# EAGLE design dsy01 (EAGLE 7.7.0)
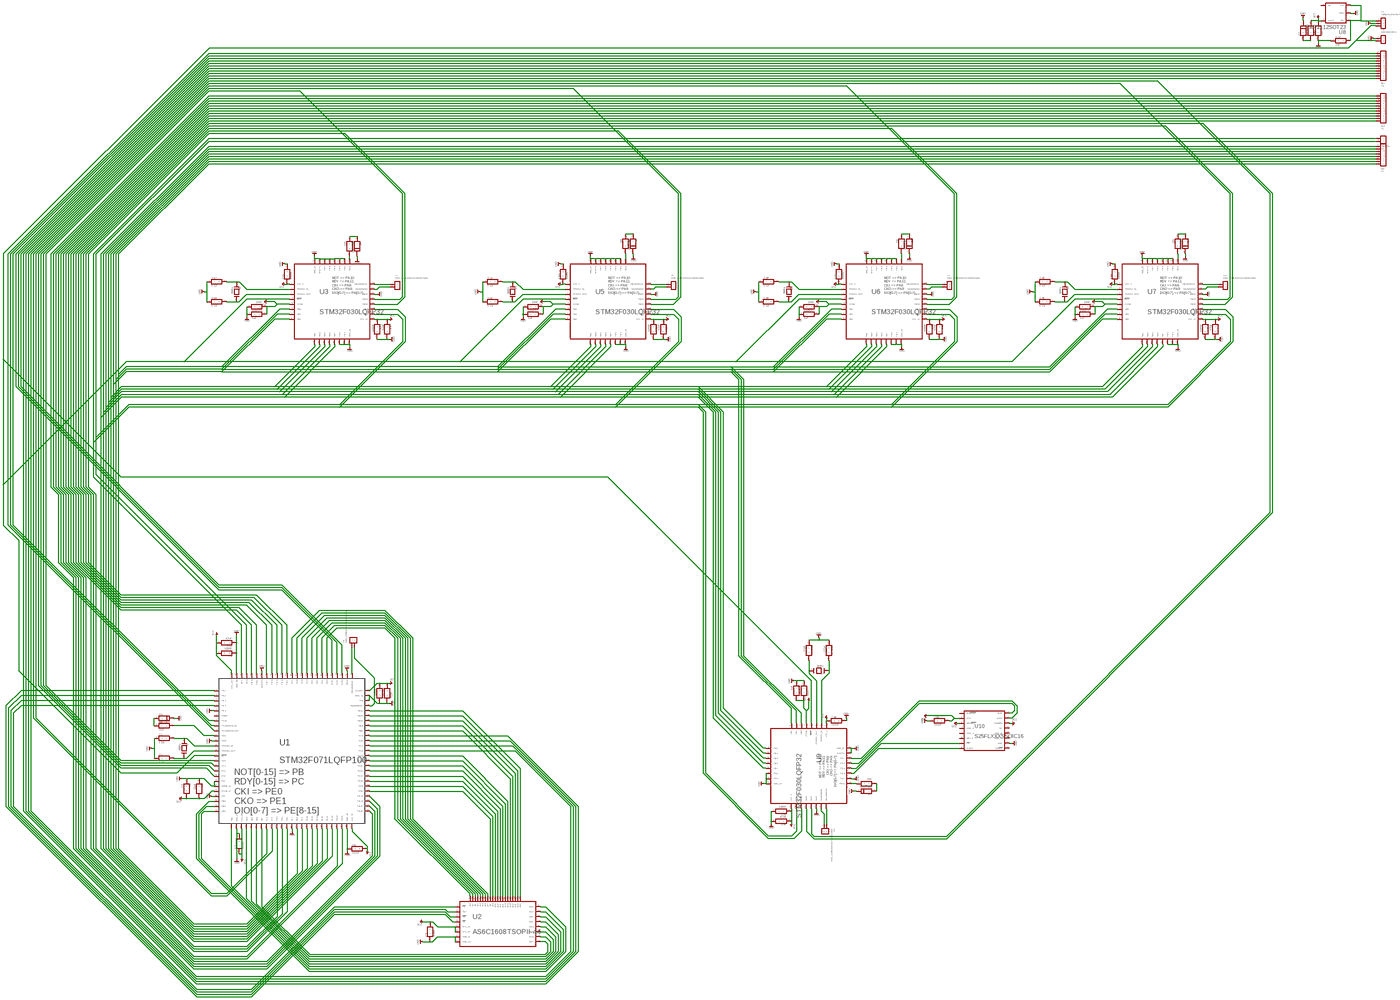
[diagram p0: schematic, sheet 1, overview]
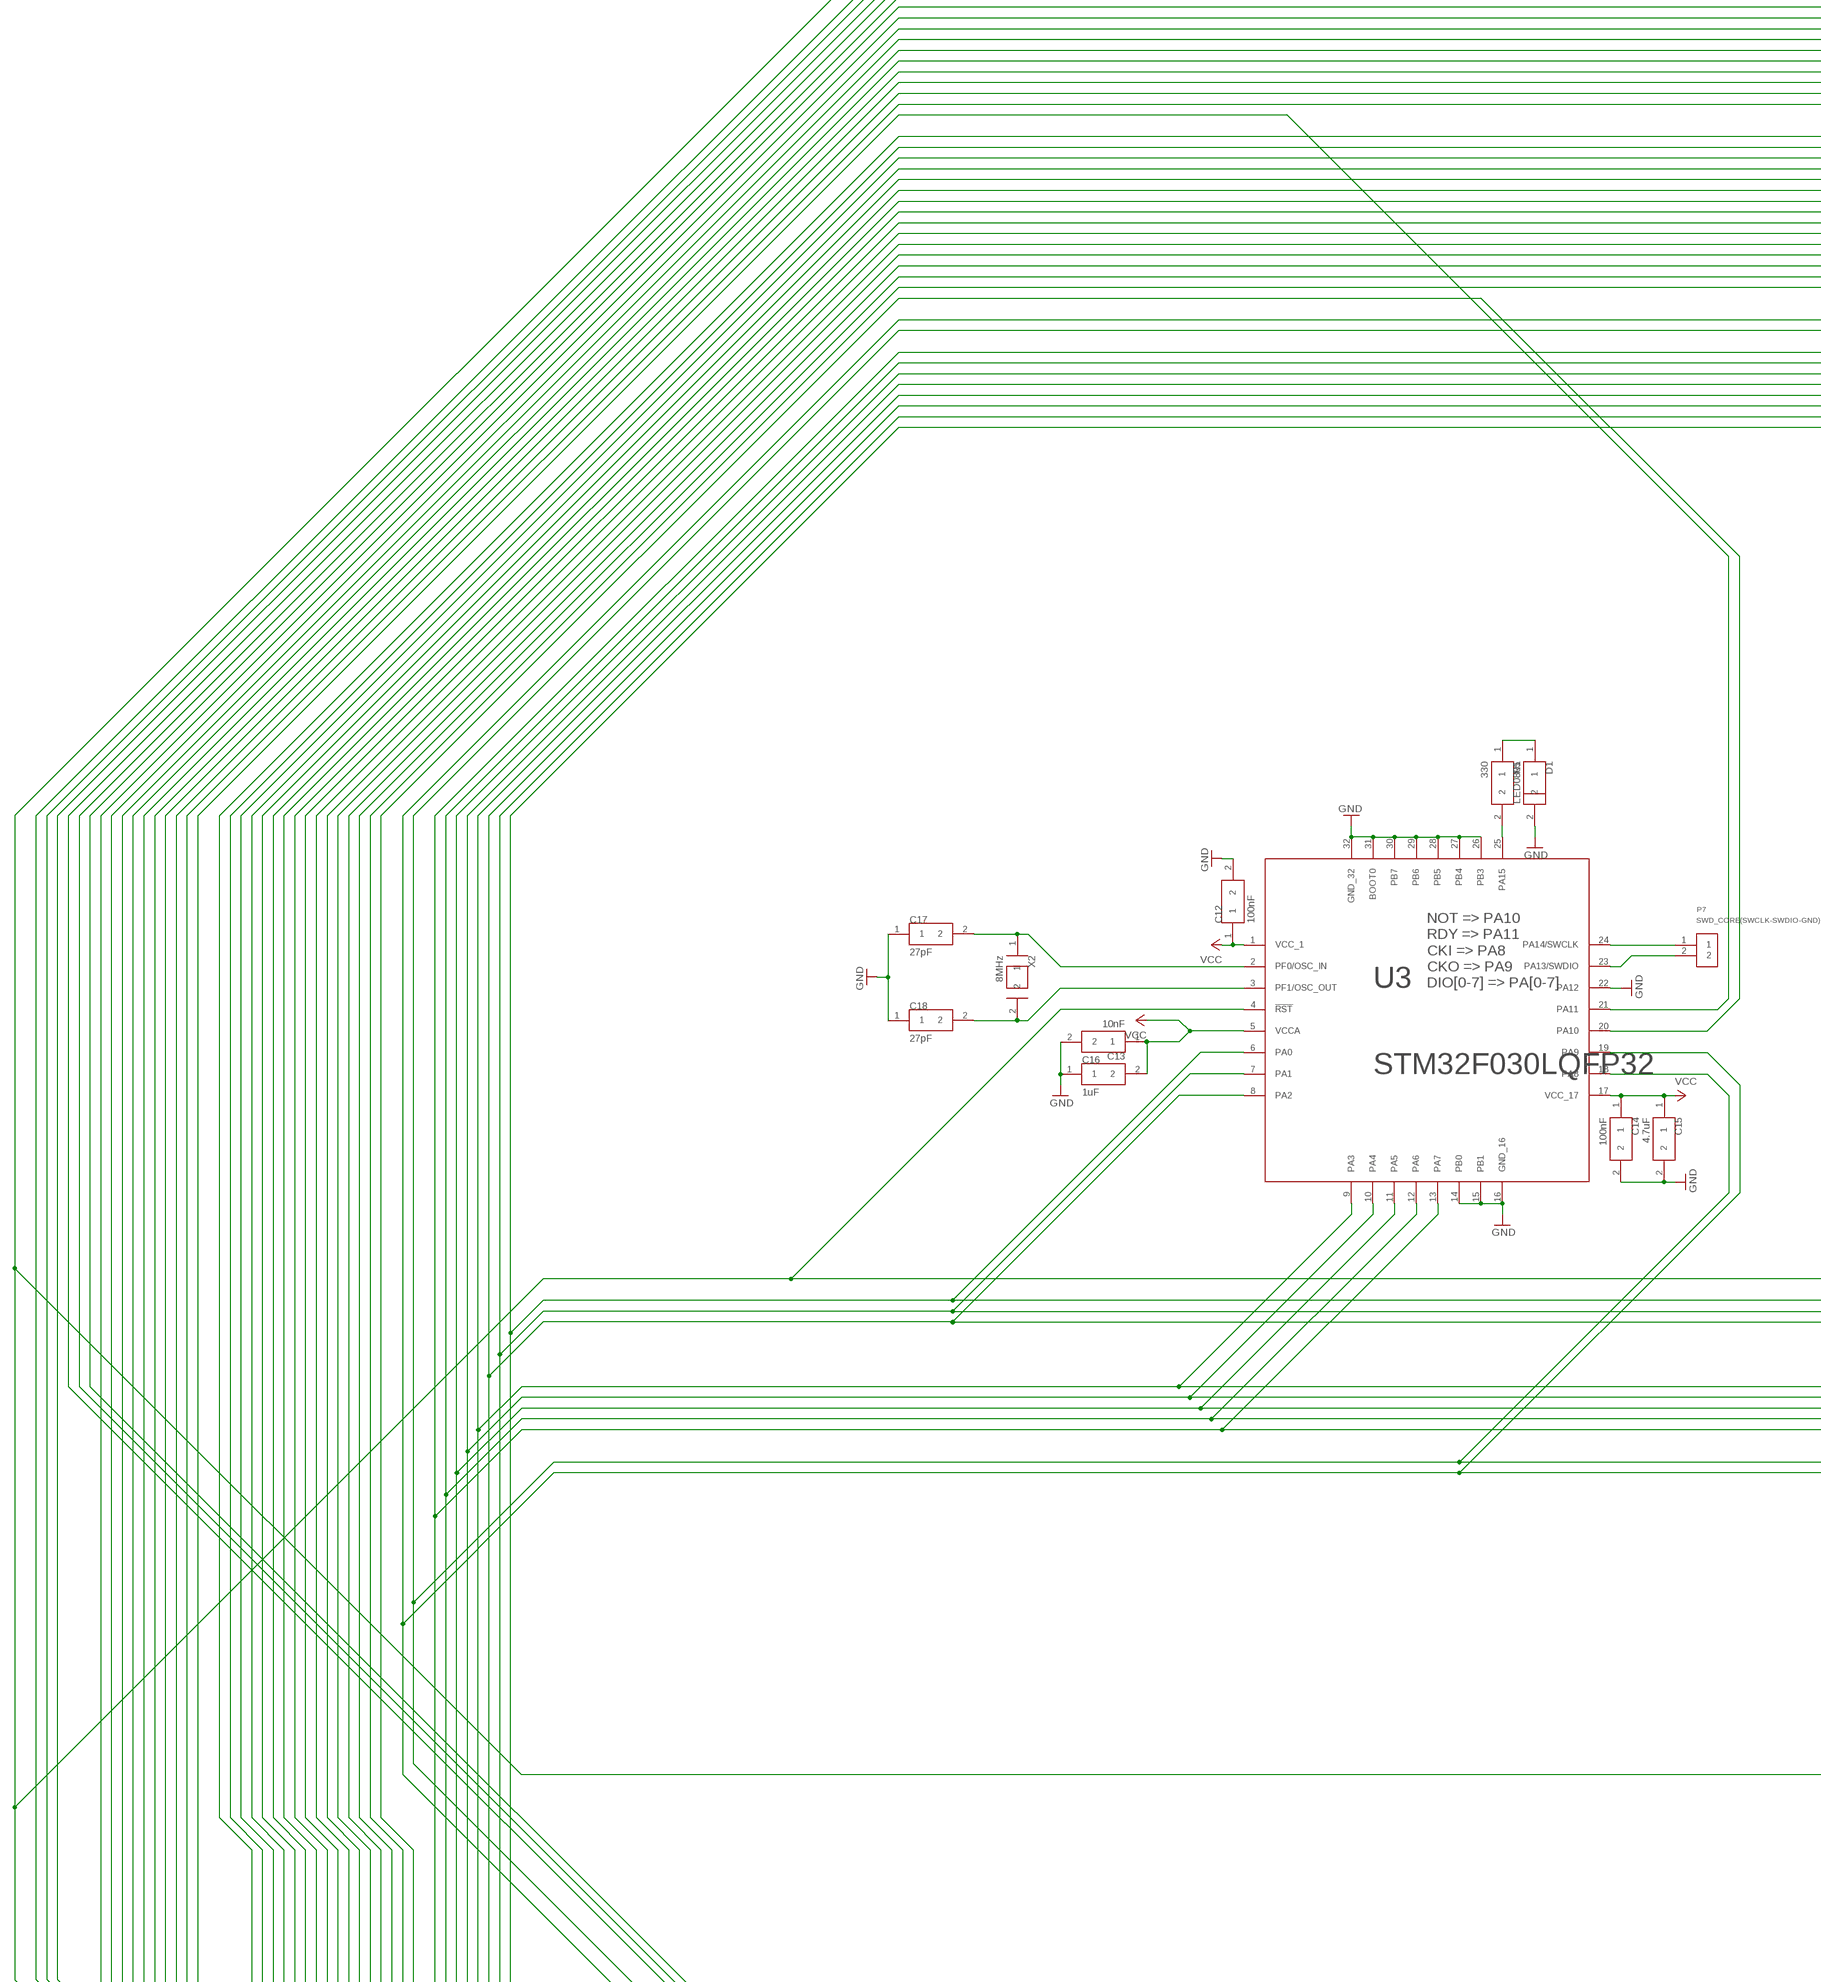
[diagram p1: schematic, sheet 1, part 1 of 7]
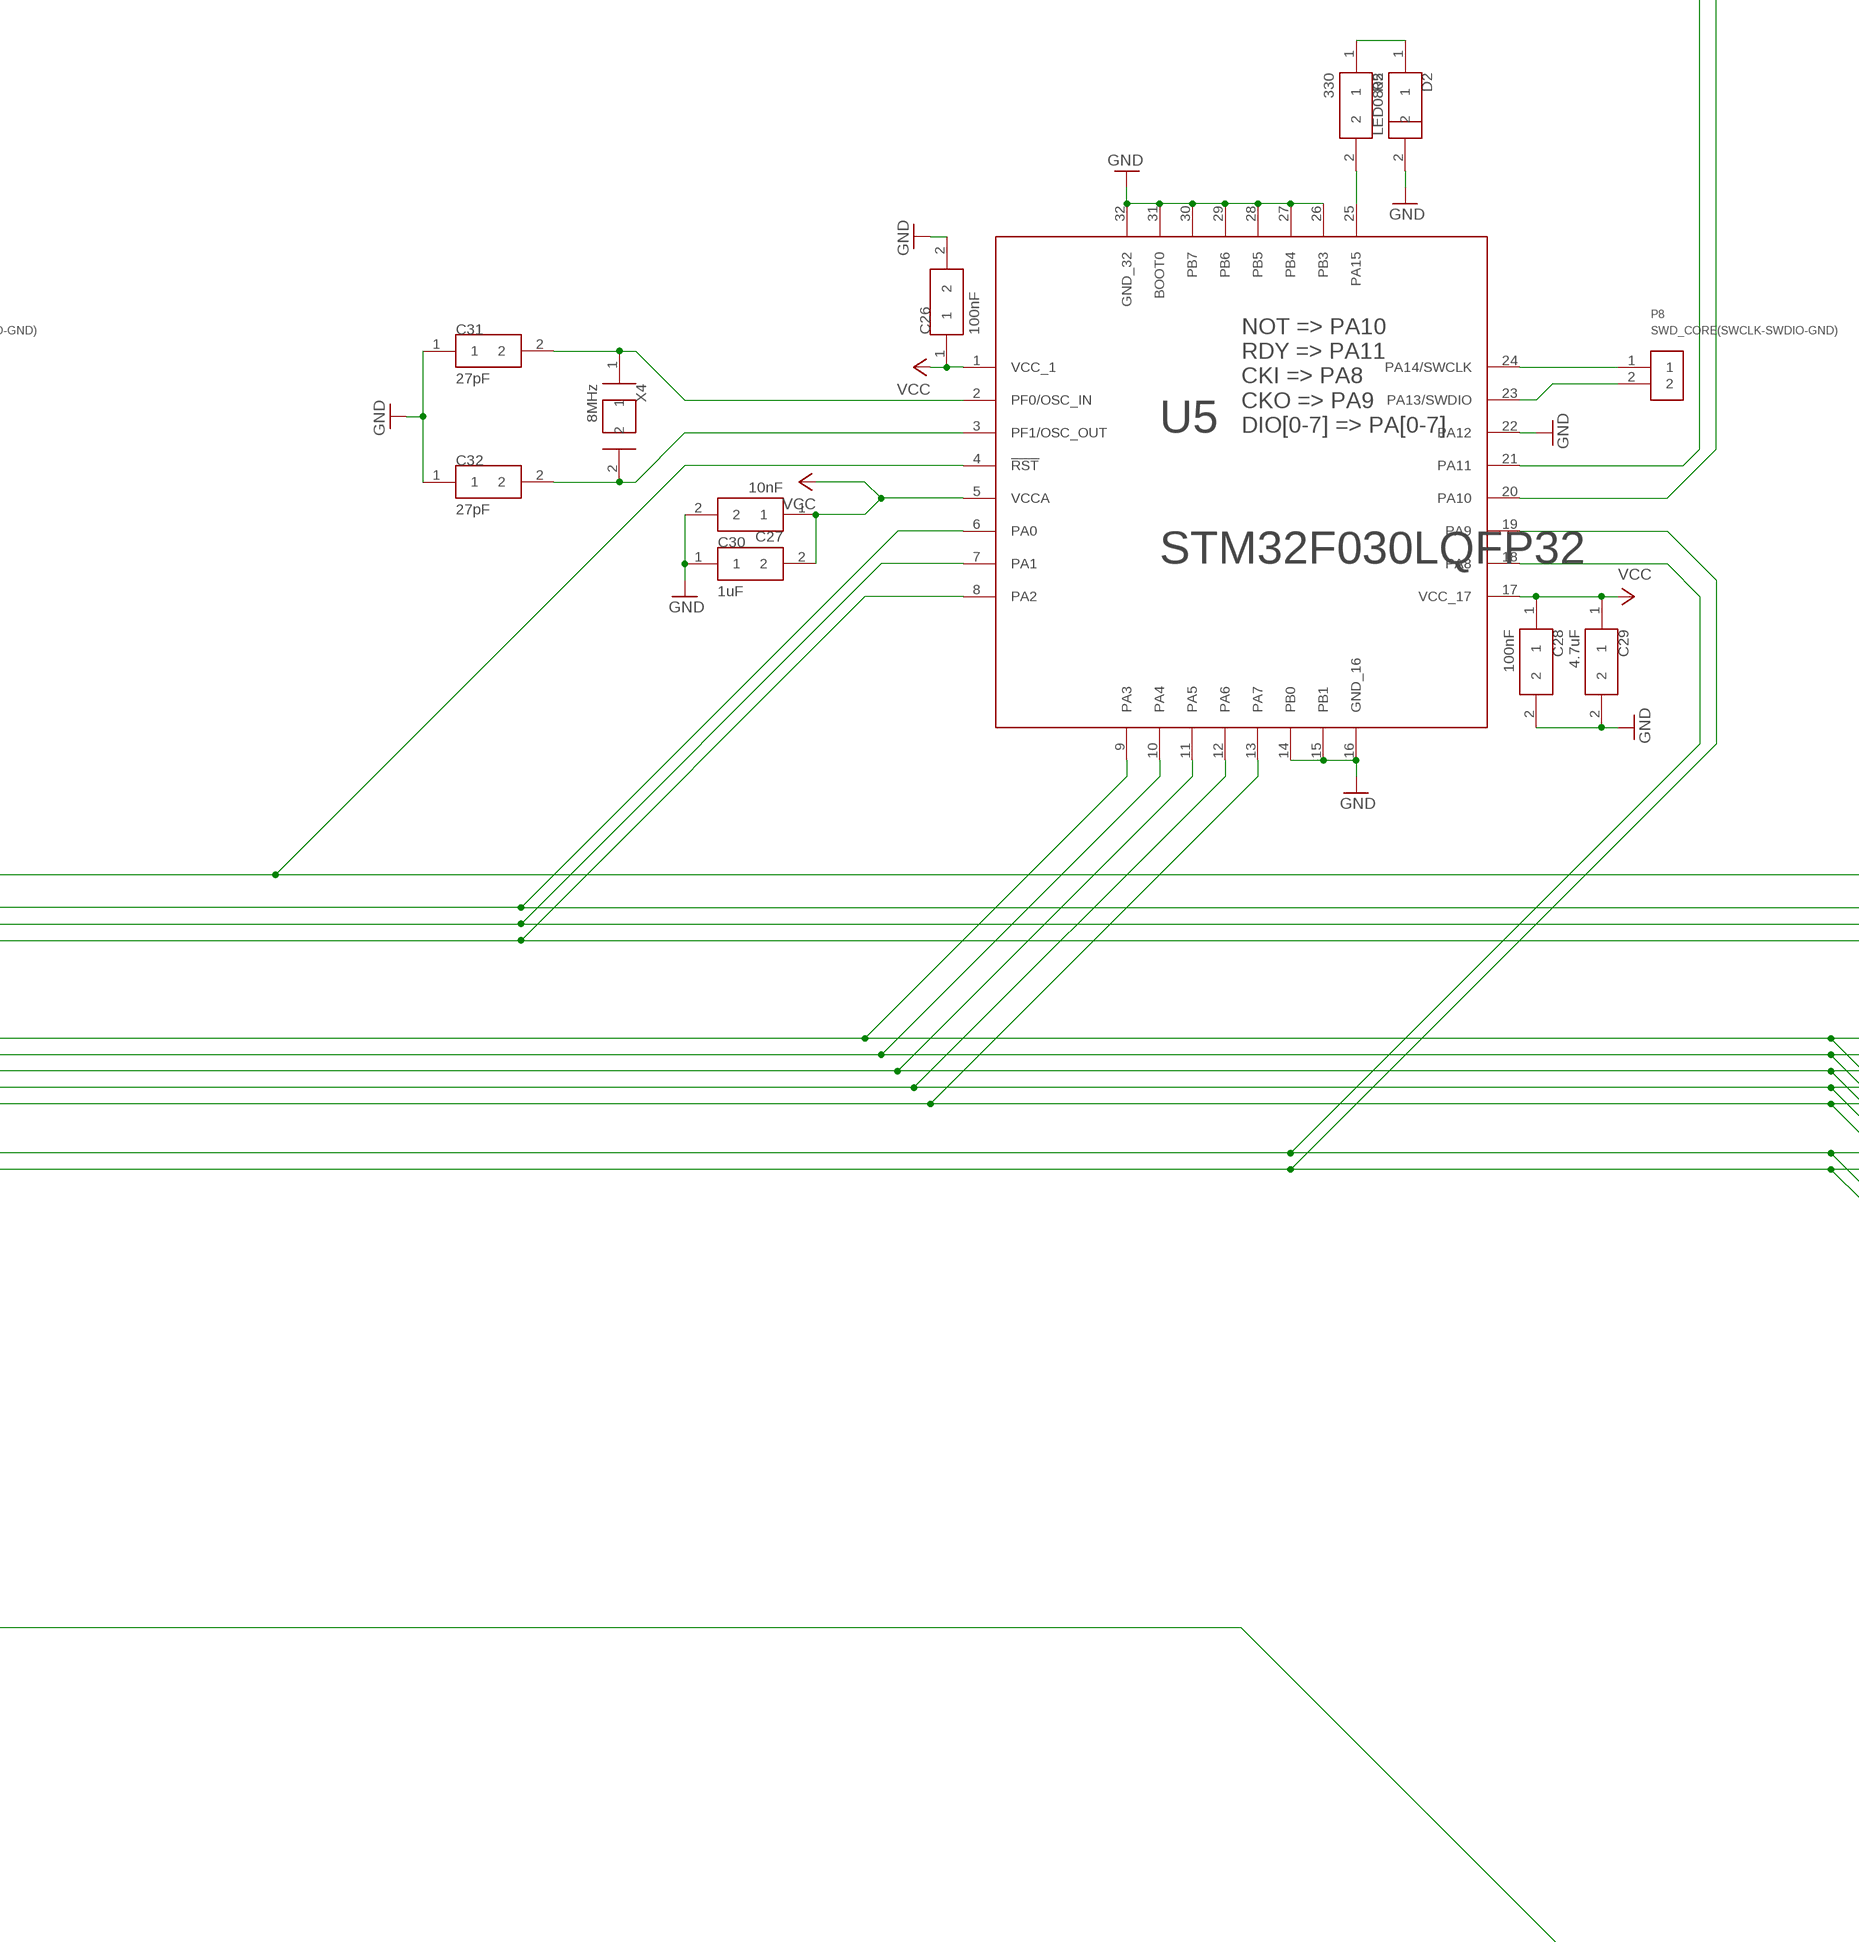
[diagram p2: schematic, sheet 1, part 2 of 7]
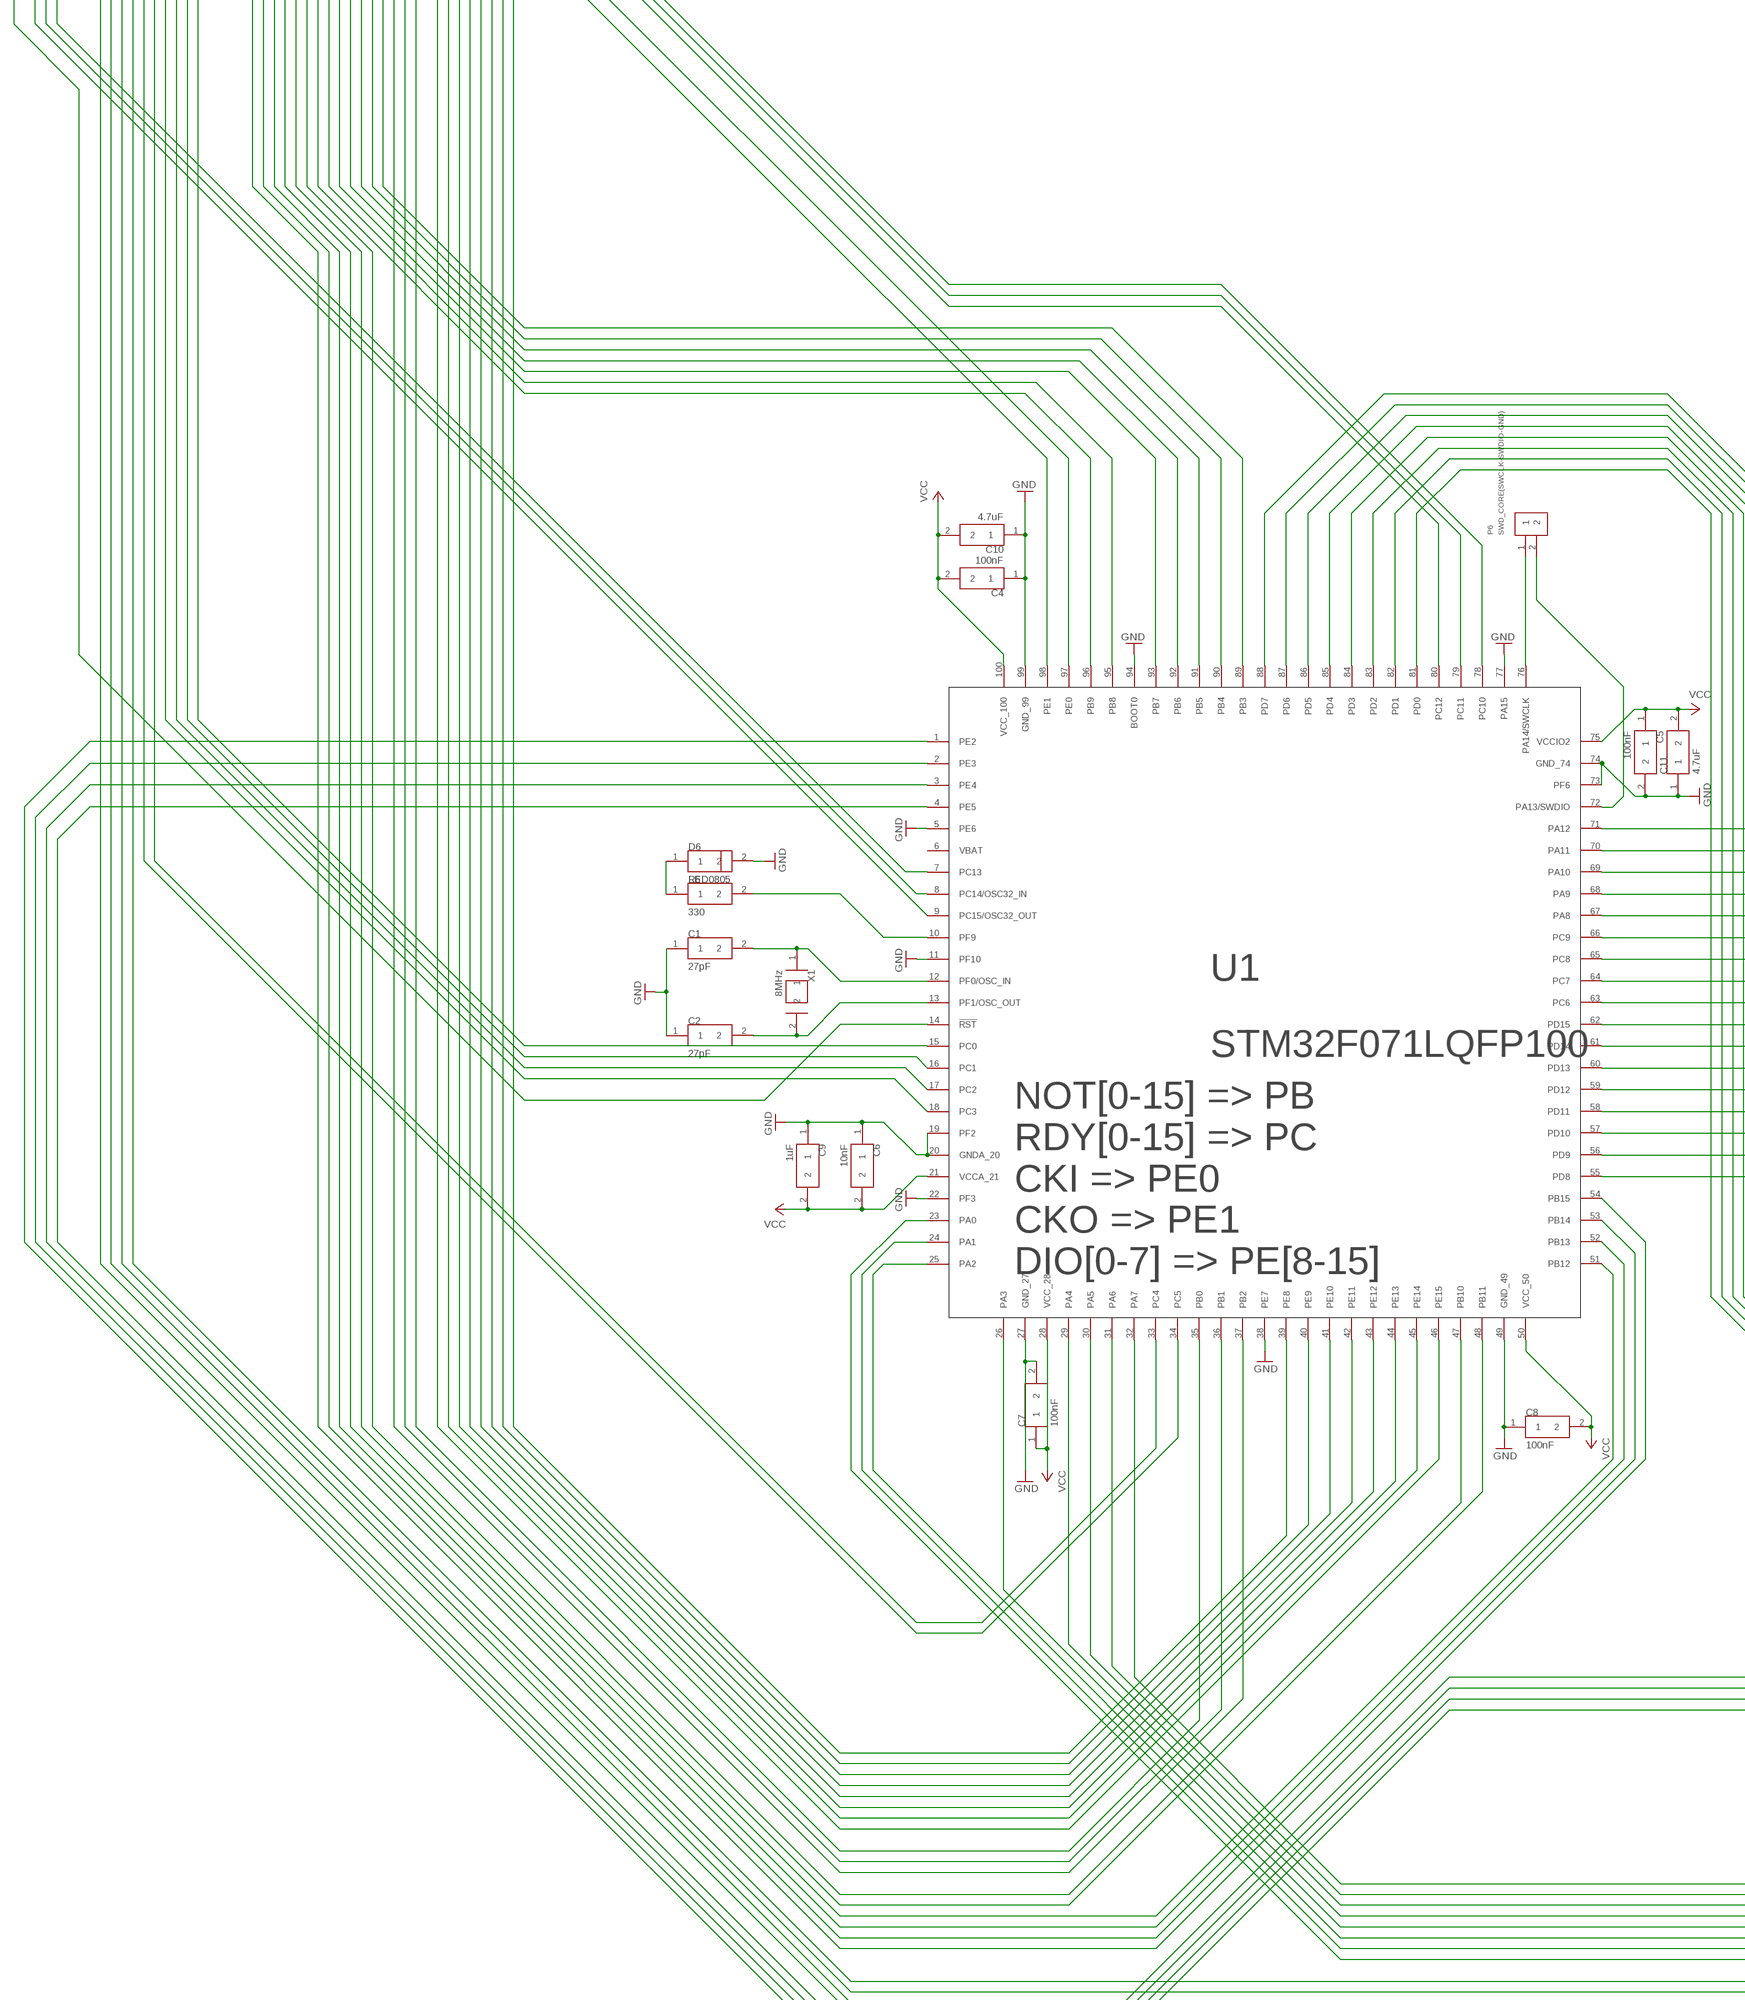
[diagram p3: schematic, sheet 1, part 3 of 7]
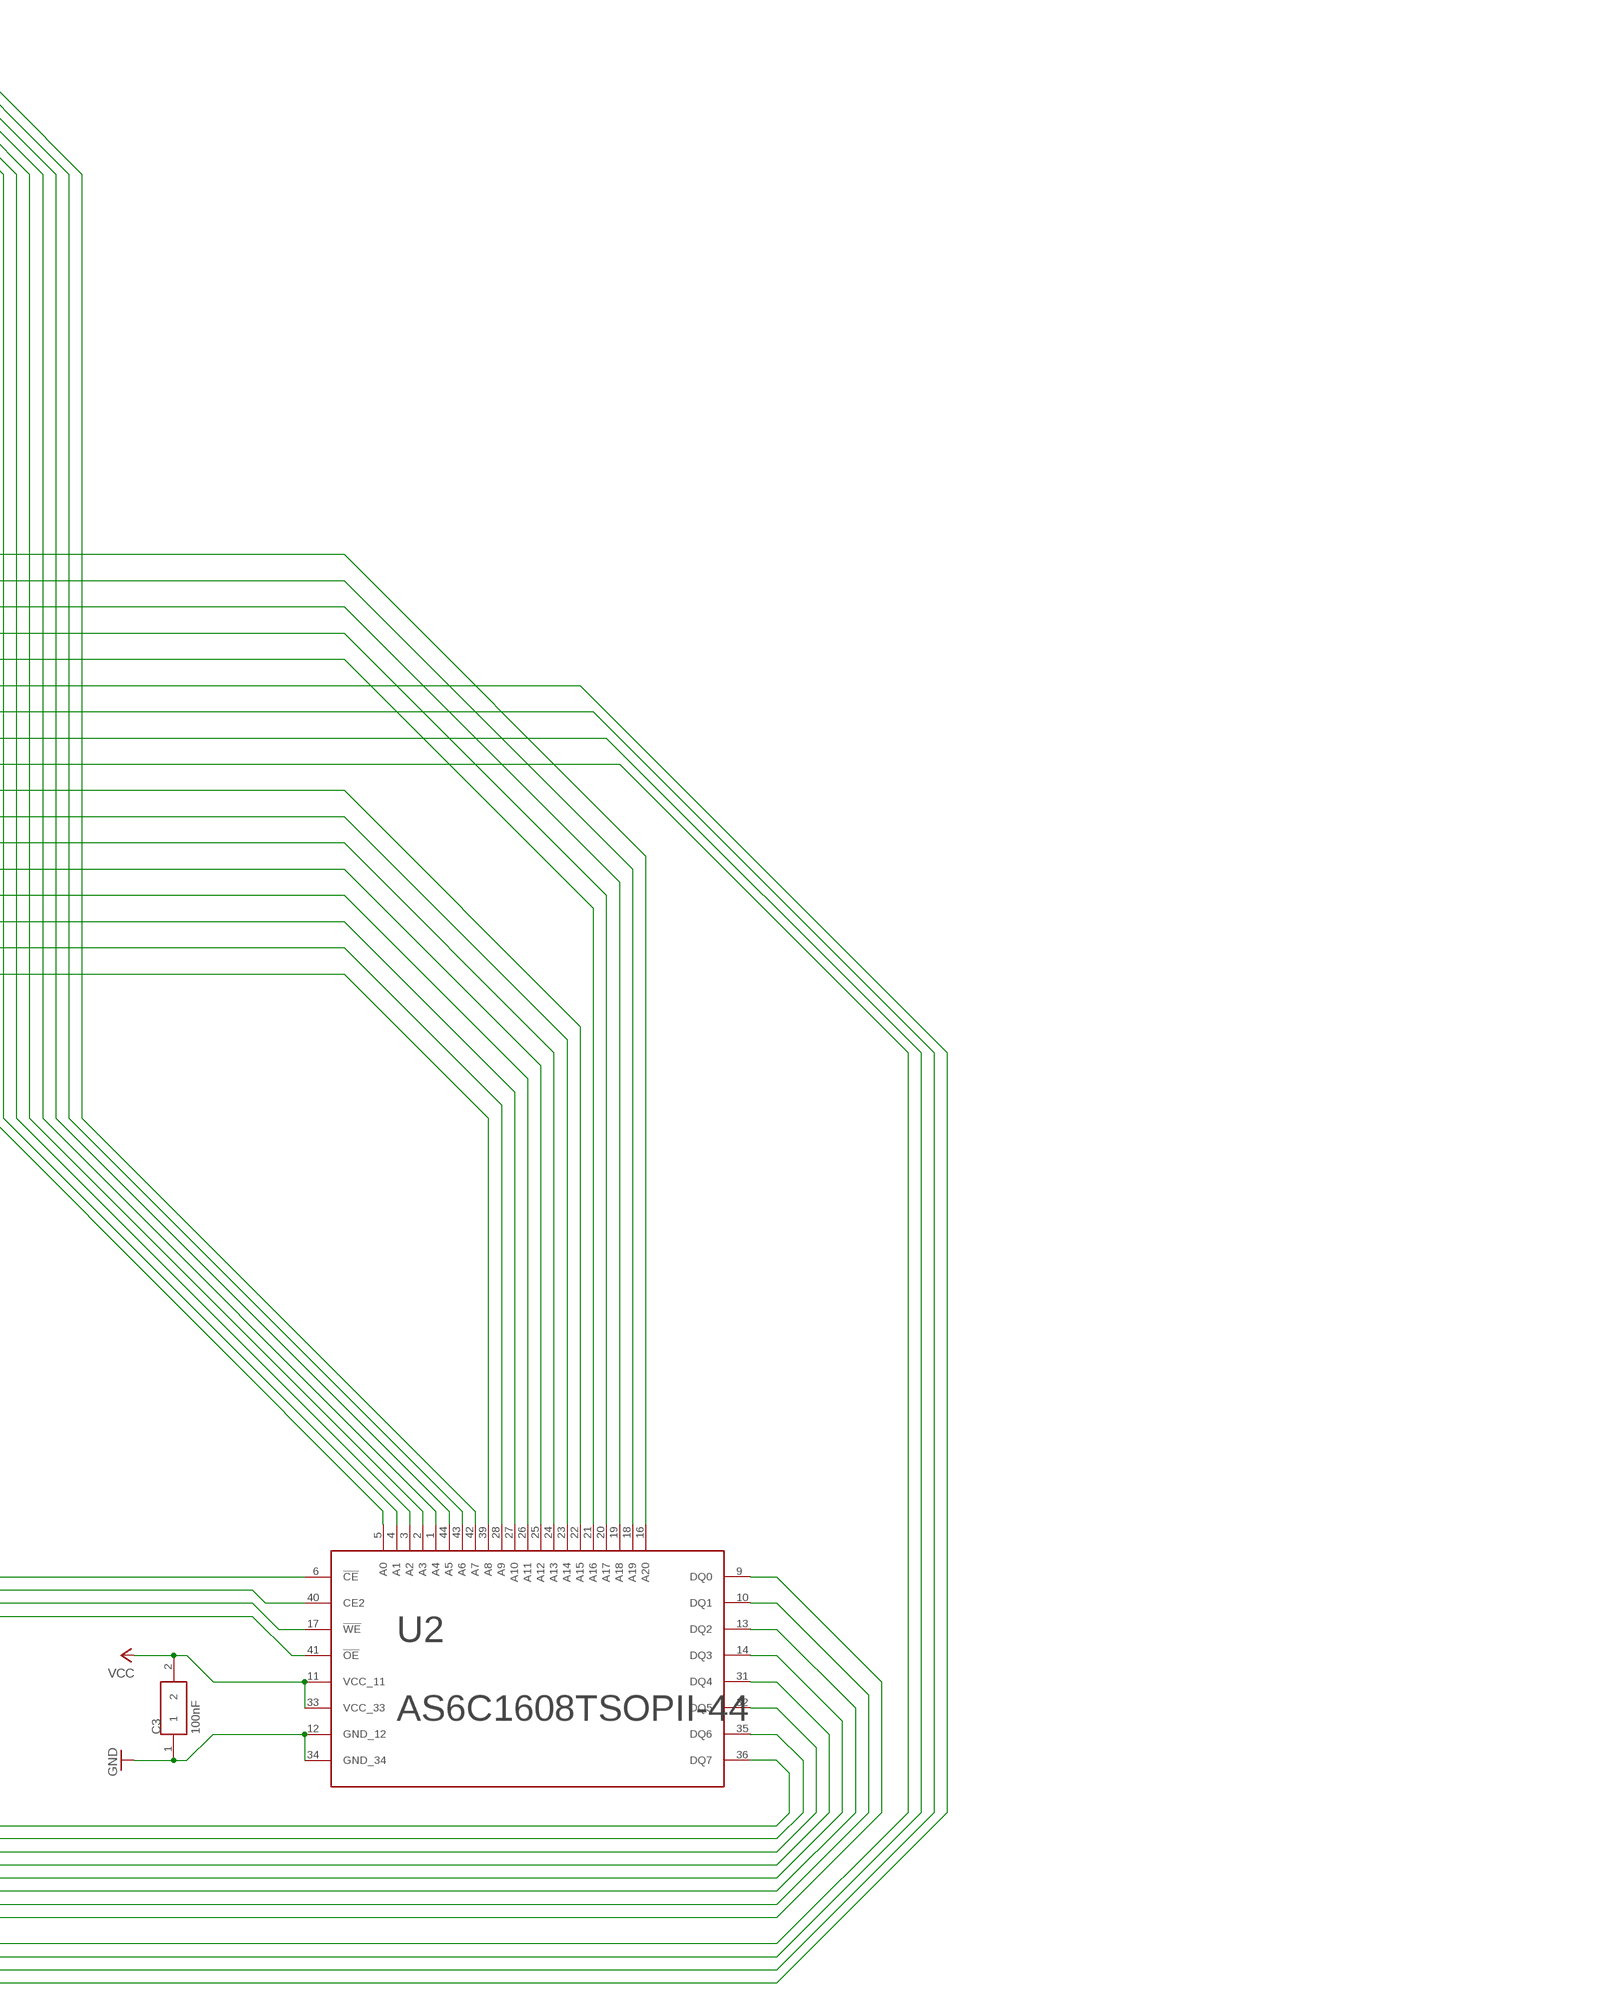
[diagram p4: schematic, sheet 1, part 4 of 7]
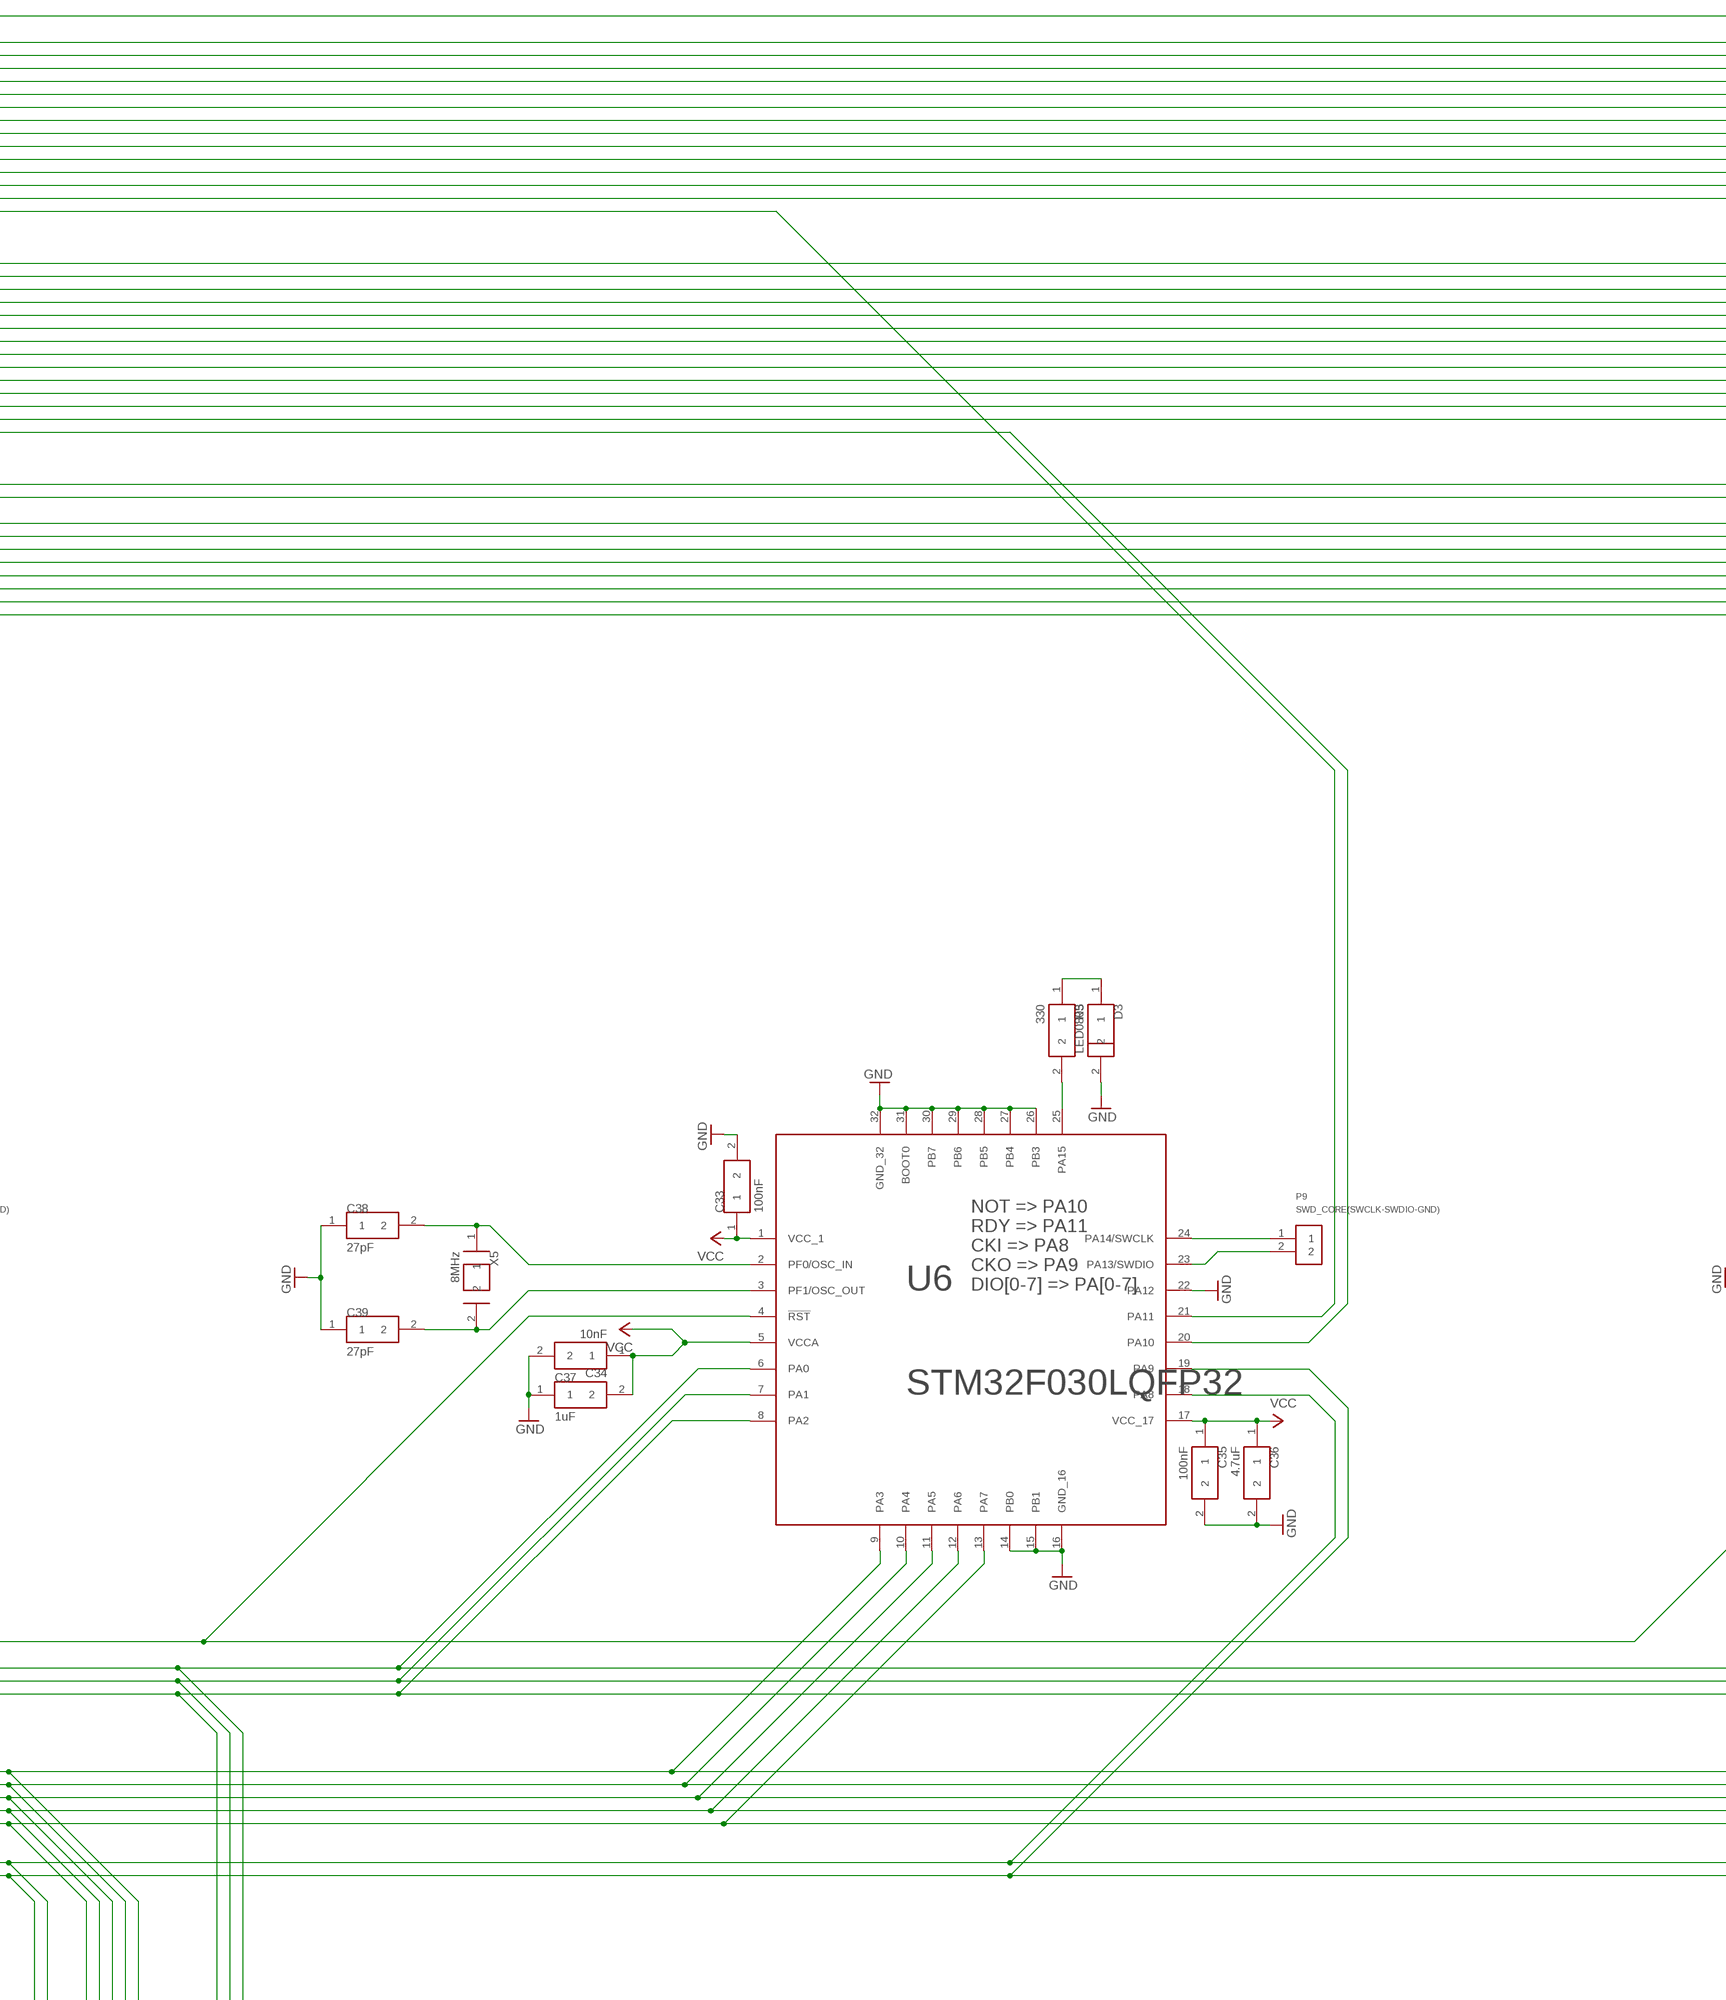
[diagram p5: schematic, sheet 1, part 5 of 7]
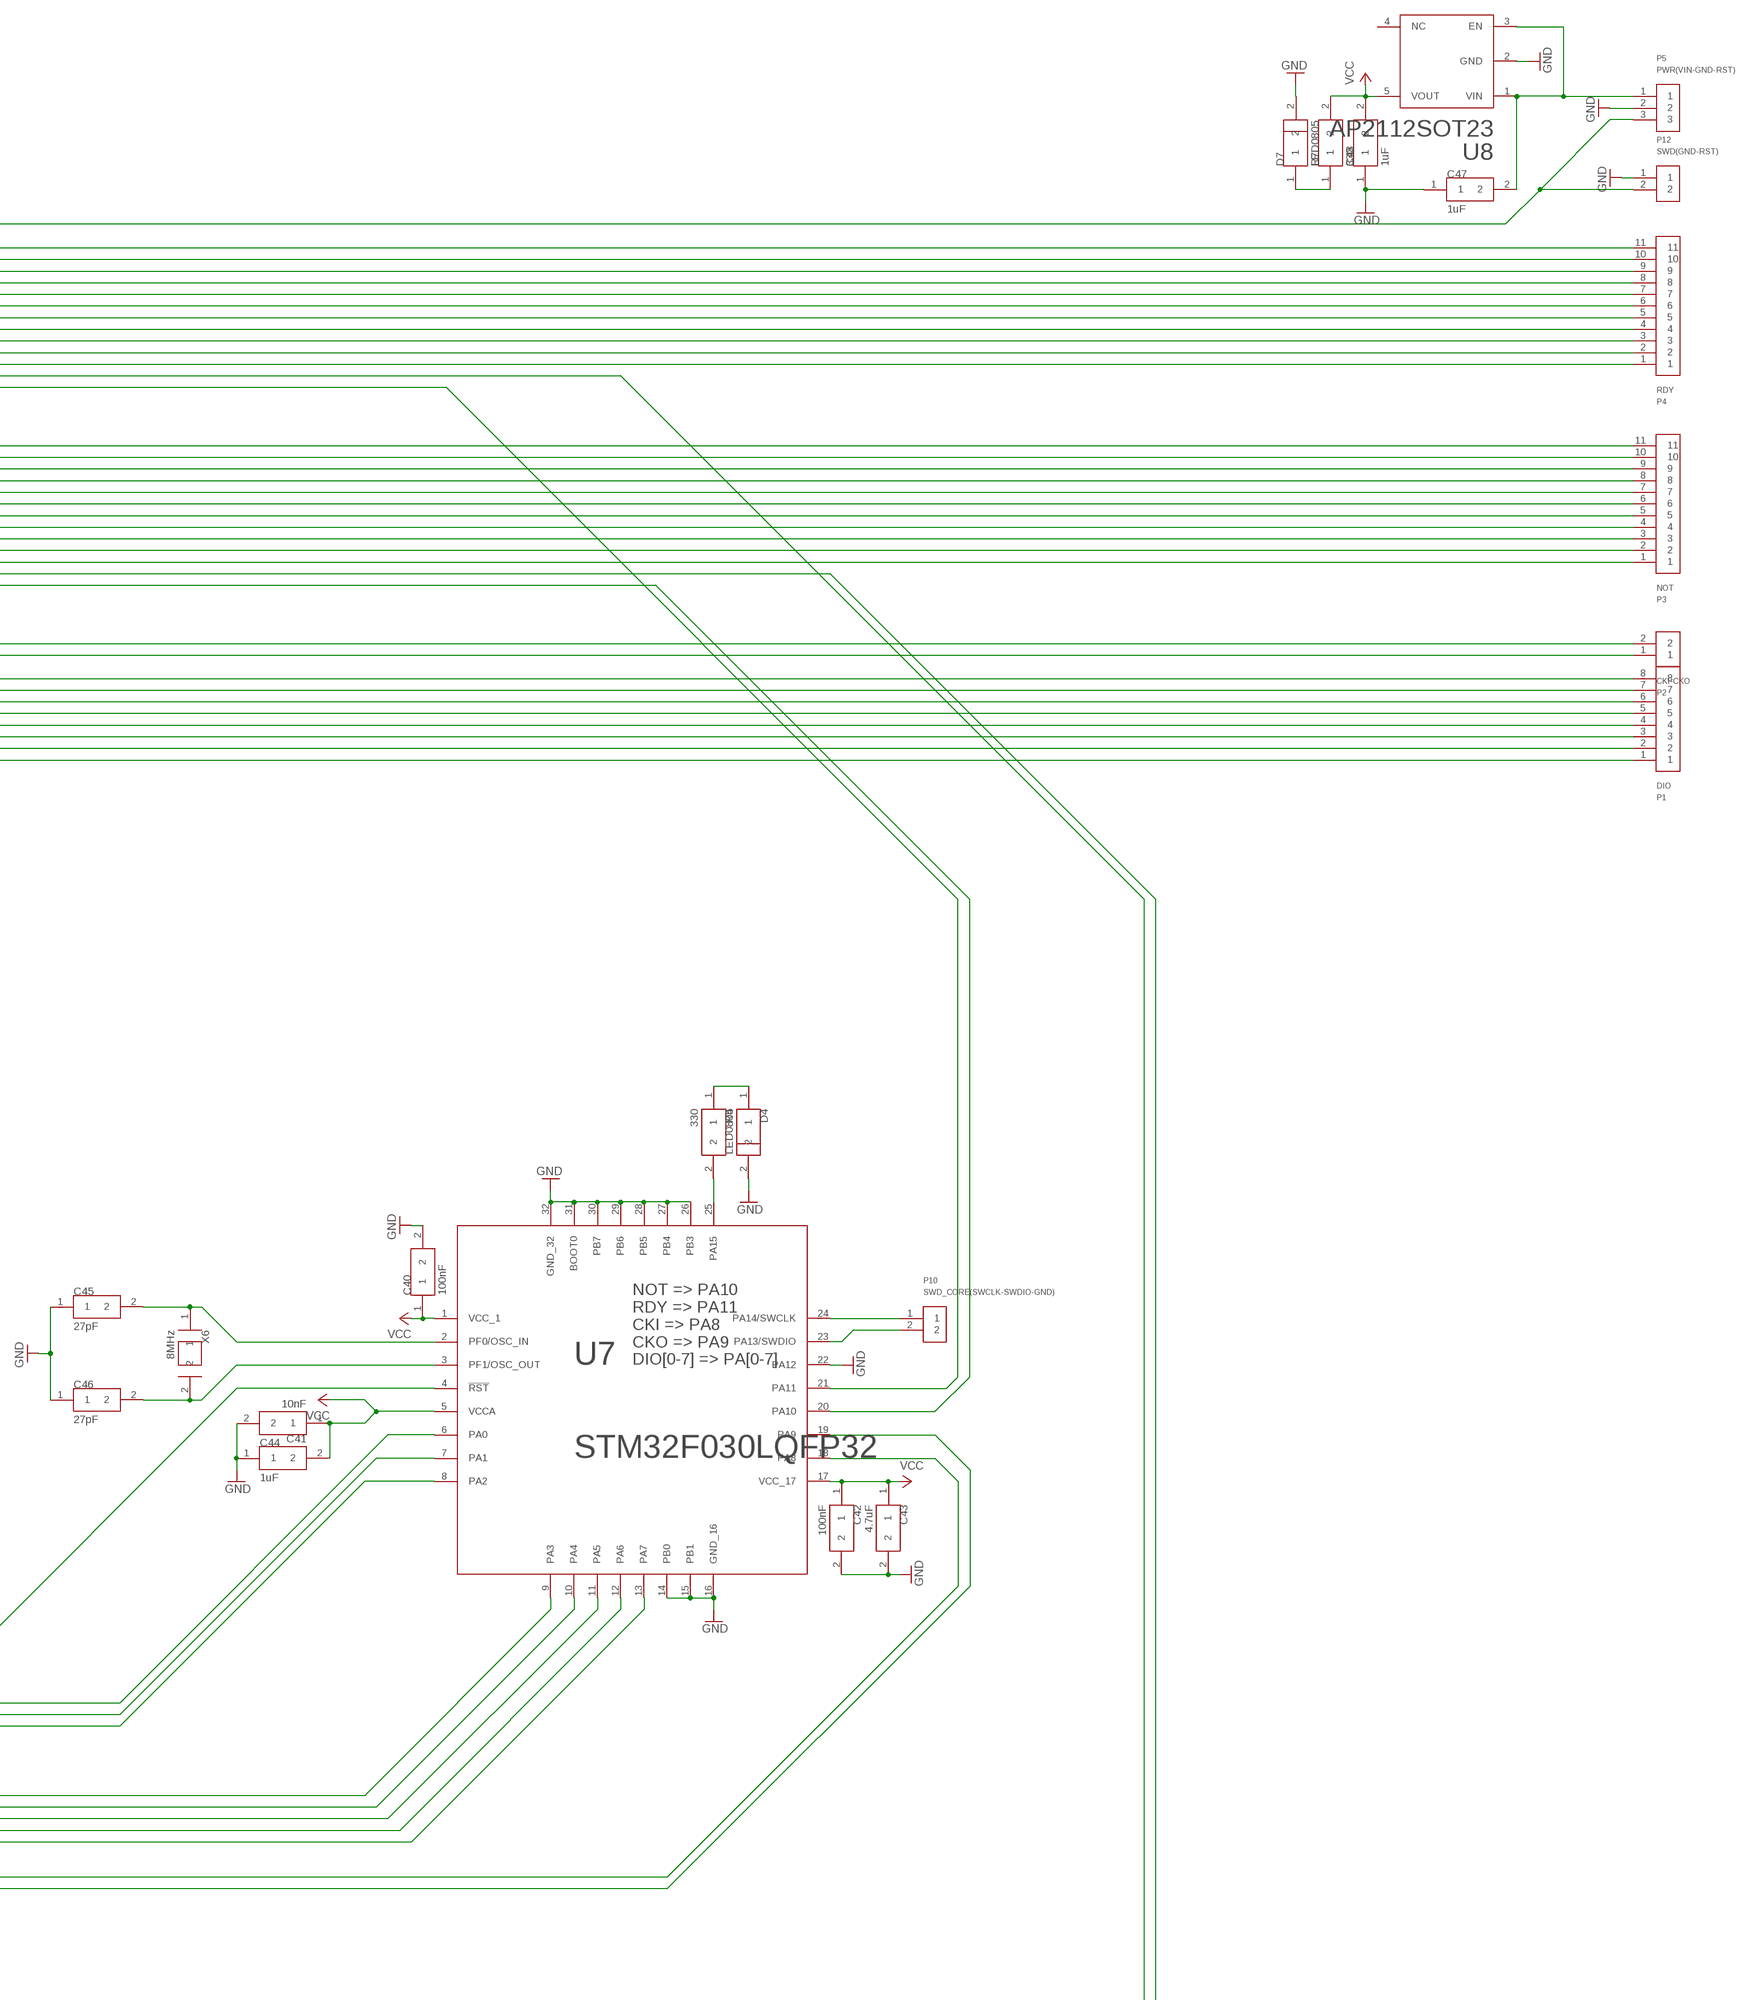
[diagram p6: schematic, sheet 1, part 6 of 7]
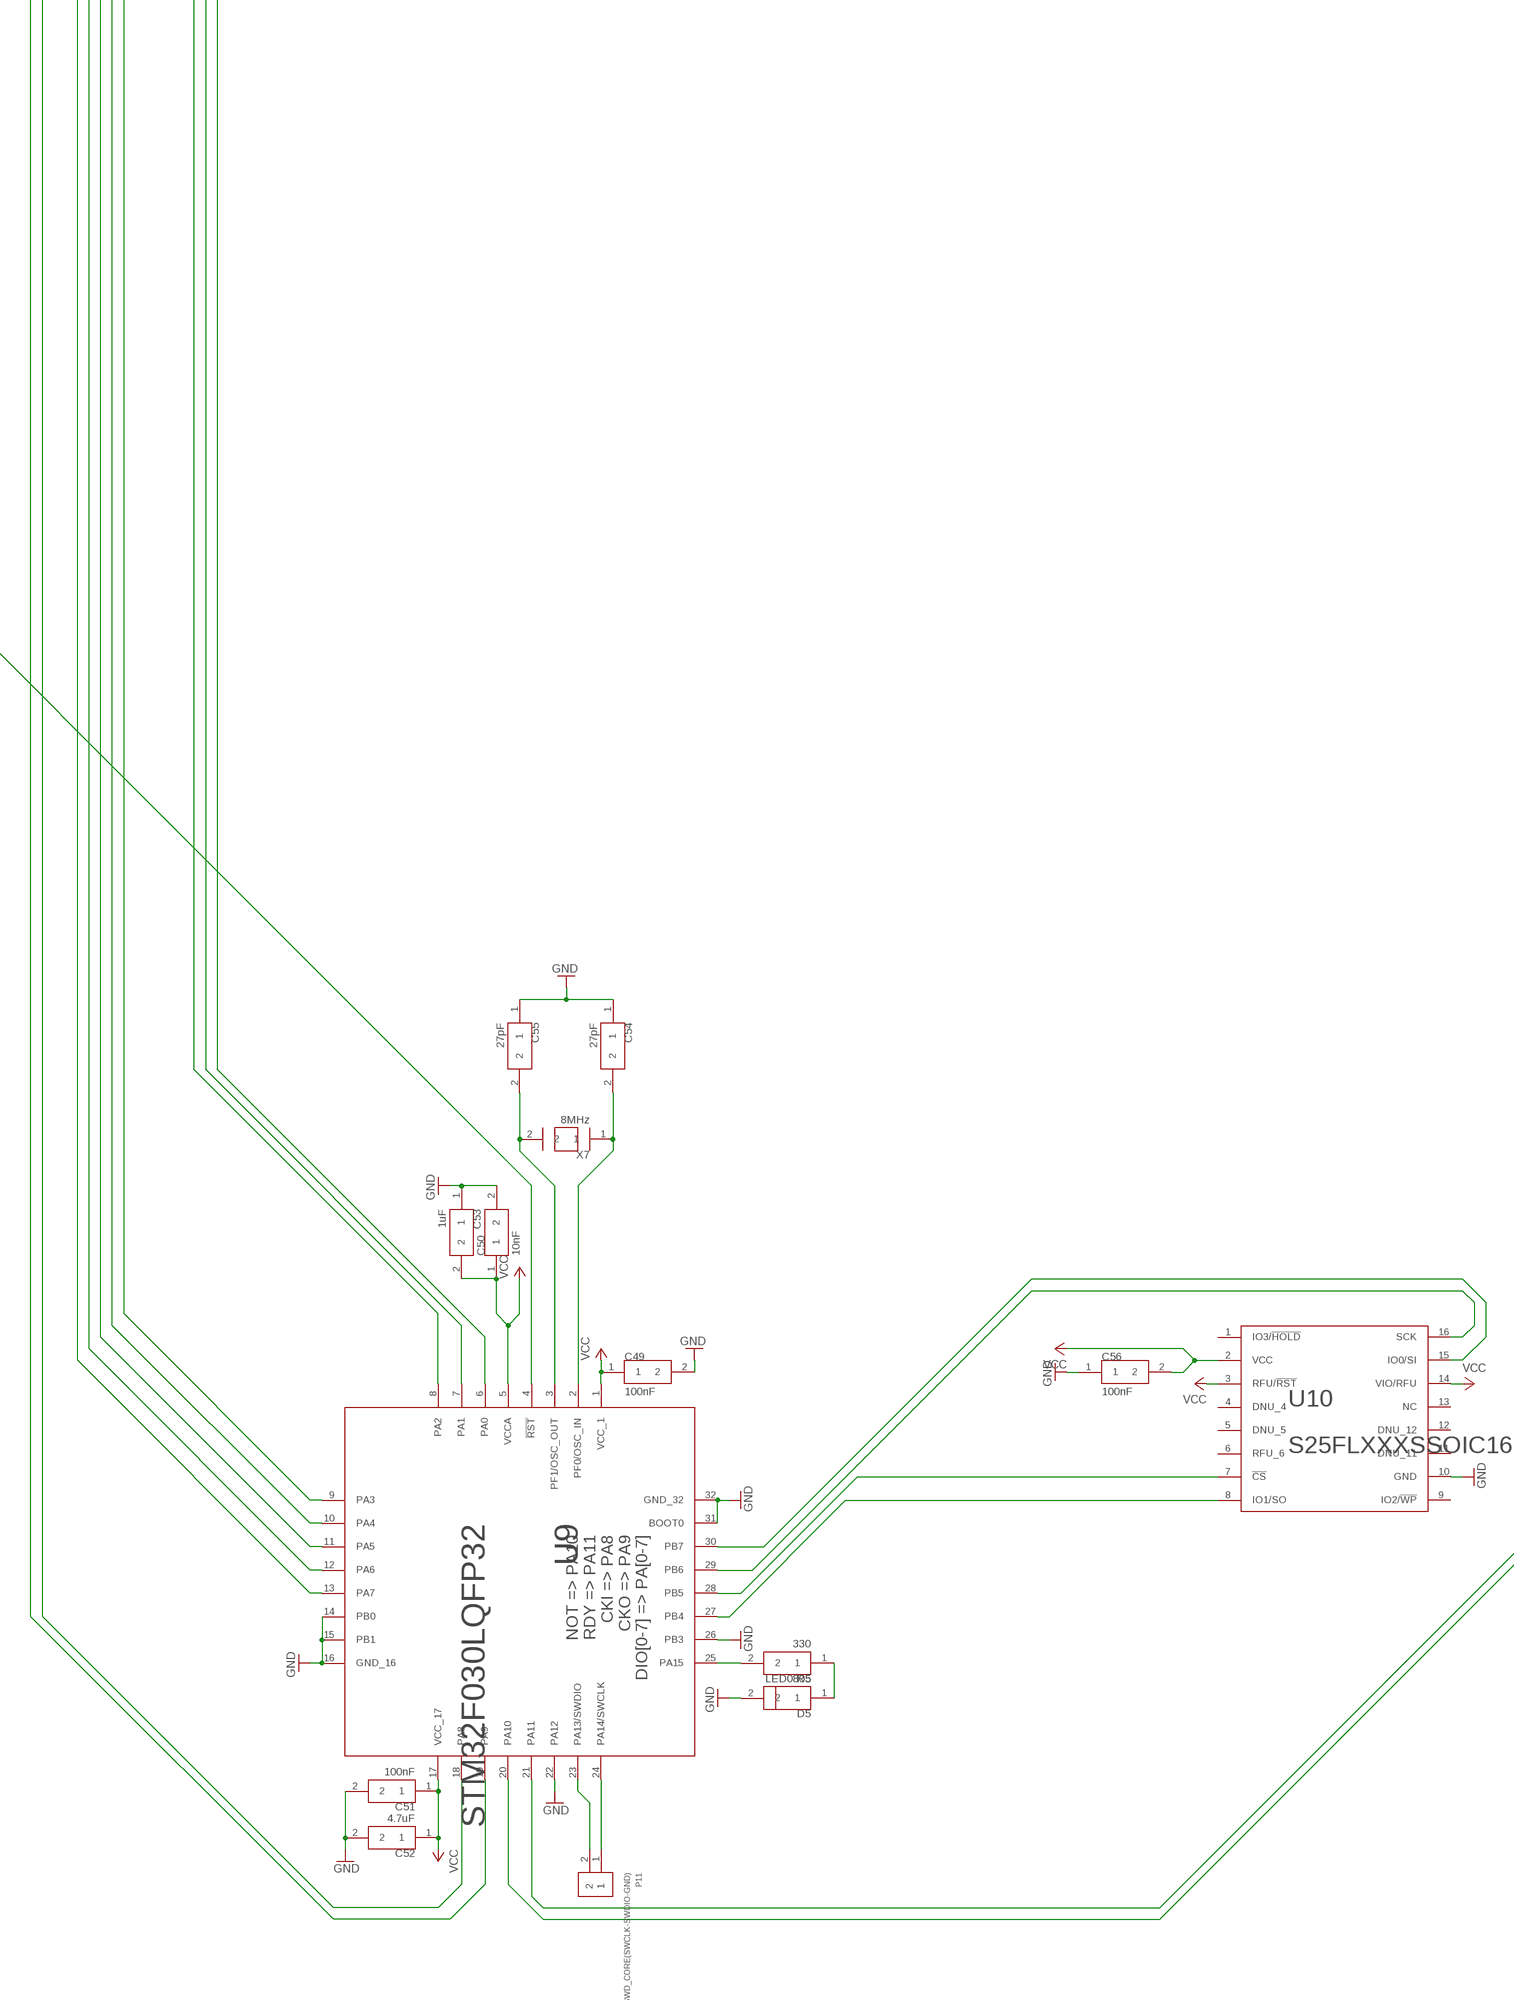
[diagram p7: schematic, sheet 1, part 7 of 7]

## Parts
C1  27pF  CAP0805  [0805]
C2  27pF  CAP0805  [0805]
C3  100nF  CAP0805  [0805]
C4  100nF  CAP0805  [0805]
C5  100nF  CAP0805  [0805]
C6  10nF  CAP0805  [0805]
C7  100nF  CAP0805  [0805]
C8  100nF  CAP0805  [0805]
C9  1uF  CAP0805  [0805]
C10  4.7uF  CAP0805  [0805]
C11  4.7uF  CAP0805  [0805]
C12  100nF  CAP0805  [0805]
C13  10nF  CAP0805  [0805]
C14  100nF  CAP0805  [0805]
C15  4.7uF  CAP0805  [0805]
C16  1uF  CAP0805  [0805]
C17  27pF  CAP0805  [0805]
C18  27pF  CAP0805  [0805]
C26  100nF  CAP0805  [0805]
C27  10nF  CAP0805  [0805]
C28  100nF  CAP0805  [0805]
C29  4.7uF  CAP0805  [0805]
C30  1uF  CAP0805  [0805]
C31  27pF  CAP0805  [0805]
C32  27pF  CAP0805  [0805]
C33  100nF  CAP0805  [0805]
C34  10nF  CAP0805  [0805]
C35  100nF  CAP0805  [0805]
C36  4.7uF  CAP0805  [0805]
C37  1uF  CAP0805  [0805]
C38  27pF  CAP0805  [0805]
C39  27pF  CAP0805  [0805]
C40  100nF  CAP0805  [0805]
C41  10nF  CAP0805  [0805]
C42  100nF  CAP0805  [0805]
C43  4.7uF  CAP0805  [0805]
C44  1uF  CAP0805  [0805]
C45  27pF  CAP0805  [0805]
C46  27pF  CAP0805  [0805]
C47  1uF  CAP0805  [0805]
C48  1uF  CAP0805  [0805]
C49  100nF  CAP0805  [0805]
C50  10nF  CAP0805  [0805]
C51  100nF  CAP0805  [0805]
C52  4.7uF  CAP0805  [0805]
C53  1uF  CAP0805  [0805]
C54  27pF  CAP0805  [0805]
C55  27pF  CAP0805  [0805]
C56  100nF  CAP0805  [0805]
D1  LED0805  [0805]
D2  LED0805  [0805]
D3  LED0805  [0805]
D4  LED0805  [0805]
D5  LED0805  [0805]
D6  LED0805  [0805]
D7  LED0805  [0805]
P1  DIO  PIN_8  [PIN_8]
P2  CKI-CKO  PIN_2  [PIN_2]
P3  NOT  PIN_11  [PIN_11]
P4  RDY  PIN_11  [PIN_11]
P5  PWR(VIN-GND-RST)  PIN_3  [PIN_3]
P6  SWD_CORE(SWCLK-SWDIO-GND)  PIN_2  [PIN_2]
P7  SWD_CORE(SWCLK-SWDIO-GND)  PIN_2  [PIN_2]
P8  SWD_CORE(SWCLK-SWDIO-GND)  PIN_2  [PIN_2]
P9  SWD_CORE(SWCLK-SWDIO-GND)  PIN_2  [PIN_2]
P10  SWD_CORE(SWCLK-SWDIO-GND)  PIN_2  [PIN_2]
P11  SWD_CORE(SWCLK-SWDIO-GND)  PIN_2  [PIN_2]
P12  SWD(GND-RST)  PIN_2  [PIN_2]
R1  330  RES0805  [0805]
R2  330  RES0805  [0805]
R3  330  RES0805  [0805]
R4  330  RES0805  [0805]
R5  330  RES0805  [0805]
R6  330  RES0805  [0805]
R7  330  RES0805  [0805]
U1  STM32F071LQFP100  [QFP100]
U2  AS6C1608TSOPII-44  [TSOPII-44]
U3  STM32F030LQFP32  [QFP32]
U5  STM32F030LQFP32  [QFP32]
U6  STM32F030LQFP32  [QFP32]
U7  STM32F030LQFP32  [QFP32]
U8  AP2112SOT23  [SOT23-5]
U9  STM32F030LQFP32  [QFP32]
U10  S25FLXXXSSOIC16  [SO3-016]
X1  8MHz  XTALSMD-5X32  [XTAL_532]
X2  8MHz  XTALSMD-5X32  [XTAL_532]
X4  8MHz  XTALSMD-5X32  [XTAL_532]
X5  8MHz  XTALSMD-5X32  [XTAL_532]
X6  8MHz  XTALSMD-5X32  [XTAL_532]
X7  8MHz  XTALSMD-5X32  [XTAL_532]

## Nets
GND: C1.1 C2.1 C3.1 C4.1 C5.2 C6.1 C7.2 C8.1 C9.1 C10.1 C11.1 C12.2 C13.2 C14.2 C15.2 C16.1 C17.1 C18.1 C26.2 C27.2 C28.2 C29.2 C30.1 C31.1 C32.1 C33.2 C34.2 C35.2 C36.2 C37.1 C38.1 C39.1 C40.2 C41.2 C42.2 C43.2 C44.1 C45.1 C46.1 C47.1 C48.1 C49.2 C50.2 C51.2 C52.2 C53.1 C54.1 C55.1 C56.1 D1.2 D2.2 D3.2 D4.2 D5.2 D6.2 D7.2 P5.2 P12.1 U1.5(PE6) U1.11(PF10) U1.19(PF2) U1.20(GNDA_20) U1.22(PF3) U1.27(GND_27) U1.38(PE7) U1.49(GND_49) U1.73(PF6) U1.74(GND_74) U1.77(PA15) U1.94(BOOT0) U1.99(GND_99) U2.12(GND_12) U2.34(GND_34) U3.14(PB0) U3.15(PB1) U3.16(GND_16) U3.22(PA12) U3.26(PB3) U3.27(PB4) U3.28(PB5) U3.29(PB6) U3.30(PB7) U3.31(BOOT0) U3.32(GND_32) U5.14(PB0) U5.15(PB1) U5.16(GND_16) U5.22(PA12) U5.26(PB3) U5.27(PB4) U5.28(PB5) U5.29(PB6) U5.30(PB7) U5.31(BOOT0) U5.32(GND_32) U6.14(PB0) U6.15(PB1) U6.16(GND_16) U6.22(PA12) U6.26(PB3) U6.27(PB4) U6.28(PB5) U6.29(PB6) U6.30(PB7) U6.31(BOOT0) U6.32(GND_32) U7.14(PB0) U7.15(PB1) U7.16(GND_16) U7.22(PA12) U7.26(PB3) U7.27(PB4) U7.28(PB5) U7.29(PB6) U7.30(PB7) U7.31(BOOT0) U7.32(GND_32) U8.2(GND) U9.14(PB0) U9.15(PB1) U9.16(GND_16) U9.22(PA12) U9.26(PB3) U9.31(BOOT0) U9.32(GND_32) U10.10(GND)
N$1: C1.2 U1.12(PF0/OSC_IN) X1.1
N$2: C2.2 U1.13(PF1/OSC_OUT) X1.2
N$3: U1.55(PD8) U2.39(A8)
N$4: U1.32(PA7) U2.36(DQ7)
N$5: U1.31(PA6) U2.35(DQ6)
N$6: U1.30(PA5) U2.32(DQ5)
N$7: U1.29(PA4) U2.31(DQ4)
N$8: U1.26(PA3) U2.14(DQ3)
N$9: U1.25(PA2) U2.13(DQ2)
N$10: U1.24(PA1) U2.10(DQ1)
N$11: U1.23(PA0) U2.9(DQ0)
N$12: U1.56(PD9) U2.28(A9)
N$13: U1.57(PD10) U2.27(A10)
N$14: U1.58(PD11) U2.26(A11)
N$15: U1.59(PD12) U2.25(A12)
N$16: U1.60(PD13) U2.24(A13)
N$17: U1.61(PD14) U2.23(A14)
N$18: U1.62(PD15) U2.22(A15)
N$19: U1.67(PA8) U2.21(A16)
N$20: U1.68(PA9) U2.20(A17)
N$21: U1.69(PA10) U2.19(A18)
N$22: U1.70(PA11) U2.18(A19)
N$23: U1.71(PA12) U2.16(A20)
N$24: U1.81(PD0) U2.5(A0)
N$25: U1.82(PD1) U2.4(A1)
N$26: U1.83(PD2) U2.3(A2)
N$27: U1.84(PD3) U2.2(A3)
N$28: U1.85(PD4) U2.1(A4)
N$29: U1.86(PD5) U2.44(A5)
N$30: U1.87(PD6) U2.43(A6)
N$31: U1.88(PD7) U2.42(A7)
N$32: C17.2 U3.2(PF0/OSC_IN) X2.1
N$33: C18.2 U3.3(PF1/OSC_OUT) X2.2
N$34: C47.2 P5.1 U8.1(VIN) U8.3(EN)
N$35: P5.3 P12.2 U1.14(!RST) U3.4(!RST) U5.4(!RST) U6.4(!RST) U7.4(!RST) U9.4(!RST)
N$36: U1.1(PE2) U2.41(!OE)
N$37: U1.2(PE3) U2.17(!WE)
N$38: U1.3(PE4) U2.40(CE2)
N$39: U1.4(PE5) U2.6(!CE)
N$40: P6.1 U1.76(PA14/SWCLK)
N$41: P6.2 U1.72(PA13/SWDIO)
N$42: P7.2 U3.23(PA13/SWDIO)
N$43: U9.29(PB6) U10.16(SCK)
N$44: U1.15(PC0) U3.21(PA11)
N$45: P10.1 U7.24(PA14/SWCLK)
N$46: P8.2 U5.23(PA13/SWDIO)
N$47: P9.1 U6.24(PA14/SWCLK)
N$48: P9.2 U6.23(PA13/SWDIO)
N$49: P8.1 U5.24(PA14/SWCLK)
N$50: P10.2 U7.23(PA13/SWDIO)
N$51: P7.1 U3.24(PA14/SWCLK)
N$52: P11.2 U9.23(PA13/SWDIO)
N$53: P11.1 U9.24(PA14/SWCLK)
N$54: D1.1 R1.1
N$55: P1.2 U1.40(PE9) U3.7(PA1) U5.7(PA1) U6.7(PA1) U7.7(PA1) U9.7(PA1)
N$56: R1.2 U3.25(PA15)
N$57: P3.5 U1.96(PB9)
N$58: P3.4 U1.95(PB8)
N$59: P3.3 U1.93(PB7)
N$60: P3.2 U1.92(PB6)
N$61: P3.1 U1.91(PB5)
N$62: D2.1 R2.1
N$63: P1.3 U1.41(PE10) U3.8(PA2) U5.8(PA2) U6.8(PA2) U7.8(PA2) U9.8(PA2)
N$64: P3.6 U1.47(PB10)
N$65: P3.7 U1.48(PB11)
N$66: P3.8 U1.51(PB12)
N$67: P3.9 U1.52(PB13)
N$68: P3.10 U1.53(PB14)
N$69: P3.11 U1.54(PB15)
N$70: R2.2 U5.25(PA15)
N$71: P1.4 U1.42(PE11) U3.9(PA3) U5.9(PA3) U6.9(PA3) U7.9(PA3) U9.9(PA3)
N$72: P1.5 U1.43(PE12) U3.10(PA4) U5.10(PA4) U6.10(PA4) U7.10(PA4) U9.10(PA4)
N$73: P1.6 U1.44(PE13) U3.11(PA5) U5.11(PA5) U6.11(PA5) U7.11(PA5) U9.11(PA5)
N$74: D3.1 R3.1
N$75: P4.1 U1.34(PC5)
N$76: P4.2 U1.63(PC6)
N$77: P4.3 U1.64(PC7)
N$78: P4.4 U1.65(PC8)
N$79: P4.5 U1.66(PC9)
N$80: P4.8 U1.80(PC12)
N$81: P4.7 U1.79(PC11)
N$82: P4.6 U1.78(PC10)
N$83: P4.9 U1.7(PC13)
N$84: P4.10 U1.8(PC14/OSC32_IN)
N$85: P4.11 U1.9(PC15/OSC32_OUT)
N$86: U1.35(PB0) U3.20(PA10)
N$87: R3.2 U6.25(PA15)
N$88: D4.1 R4.1
N$89: R4.2 U7.25(PA15)
N$90: C31.2 U5.2(PF0/OSC_IN) X4.1
N$91: C32.2 U5.3(PF1/OSC_OUT) X4.2
N$92: D5.1 R5.1
N$93: P1.7 U1.45(PE14) U3.12(PA6) U5.12(PA6) U6.12(PA6) U7.12(PA6) U9.12(PA6)
N$94: P1.8 U1.46(PE15) U3.13(PA7) U5.13(PA7) U6.13(PA7) U7.13(PA7) U9.13(PA7)
N$95: P2.2 U1.98(PE1) U3.19(PA9) U5.19(PA9) U6.19(PA9) U7.19(PA9) U9.19(PA9)
N$96: P2.1 U1.97(PE0) U3.18(PA8) U5.18(PA8) U6.18(PA8) U7.18(PA8) U9.18(PA8)
N$97: P1.1 U1.39(PE8) U3.6(PA0) U5.6(PA0) U6.6(PA0) U7.6(PA0) U9.6(PA0)
N$98: C54.2 U9.2(PF0/OSC_IN) X7.1
N$99: C55.2 U9.3(PF1/OSC_OUT) X7.2
N$100: U1.90(PB4) U9.20(PA10)
N$101: U1.33(PC4) U9.21(PA11)
N$102: U1.36(PB1) U5.20(PA10)
N$103: U1.16(PC1) U5.21(PA11)
N$104: C38.2 U6.2(PF0/OSC_IN) X5.1
N$105: C39.2 U6.3(PF1/OSC_OUT) X5.2
N$106: U9.30(PB7) U10.15(IO0/SI)
N$107: U9.28(PB5) U10.7(!CS)
N$108: U9.27(PB4) U10.8(IO1/SO)
N$109: R5.2 U9.25(PA15)
N$110: D6.1 R6.1
N$111: R6.2 U1.10(PF9)
N$112: D7.1 R7.1
N$116: U1.37(PB2) U6.20(PA10)
N$117: U1.17(PC2) U6.21(PA11)
N$118: C45.2 U7.2(PF0/OSC_IN) X6.1
N$119: C46.2 U7.3(PF1/OSC_OUT) X6.2
N$130: U1.89(PB3) U7.20(PA10)
N$131: U1.18(PC3) U7.21(PA11)
VCC: C3.2 C4.2 C5.1 C6.2 C7.1 C8.2 C9.2 C10.2 C11.2 C12.1 C13.1 C14.1 C15.1 C16.2 C26.1 C27.1 C28.1 C29.1 C30.2 C33.1 C34.1 C35.1 C36.1 C37.2 C40.1 C41.1 C42.1 C43.1 C44.2 C48.2 C49.1 C50.1 C51.1 C52.1 C53.2 C56.2 R7.2 U1.21(VCCA_21) U1.28(VCC_28) U1.50(VCC_50) U1.75(VCCIO2) U1.100(VCC_100) U2.11(VCC_11) U2.33(VCC_33) U3.1(VCC_1) U3.5(VCCA) U3.17(VCC_17) U5.1(VCC_1) U5.5(VCCA) U5.17(VCC_17) U6.1(VCC_1) U6.5(VCCA) U6.17(VCC_17) U7.1(VCC_1) U7.5(VCCA) U7.17(VCC_17) U8.5(VOUT) U9.1(VCC_1) U9.5(VCCA) U9.17(VCC_17) U10.2(VCC) U10.3(RFU/!RST) U10.14(VIO/RFU)
Unconnected: U1.6(VBAT) U8.4(NC) U10.1(IO3/!HOLD) U10.4(DNU_4) U10.5(DNU_5) U10.6(RFU_6) U10.9(IO2/!WP) U10.11(DNU_11) U10.12(DNU_12) U10.13(NC)

## Notes on the sheet
- NOT => PA10
  RDY => PA11
  CKI => PA8
  CKO => PA9
  DIO[0-7] => PA[0-7]
- NOT => PA10
  RDY => PA11
  CKI => PA8
  CKO => PA9
  DIO[0-7] => PA[0-7]
- NOT => PA10
  RDY => PA11
  CKI => PA8
  CKO => PA9
  DIO[0-7] => PA[0-7]
- NOT => PA10
  RDY => PA11
  CKI => PA8
  CKO => PA9
  DIO[0-7] => PA[0-7]
- NOT => PA10
  RDY => PA11
  CKI => PA8
  CKO => PA9
  DIO[0-7] => PA[0-7]
- NOT[0-15] => PB
  RDY[0-15] => PC
  CKI => PE0
  CKO => PE1
  DIO[0-7] => PE[8-15]

## Library data of the parts
C1-C18 C26-C56 = dooba:CAP
D1-D7 = dooba:LED
P1 = dooba:PIN_8
P2 P6-P12 = dooba:PIN_2
P3 P4 = dooba:PIN_11
P5 = dooba:PIN_3
R1-R7 = dooba:RES
U1 = dooba:STM32F071
U2 = dooba:AS6C1608
U3 U5-U7 U9 = dooba:STM32F030
U8 = dooba:AP2112
U10 = dooba:S25FLXXXS
X1 X2 X4-X7 = dooba:XTAL

## Board
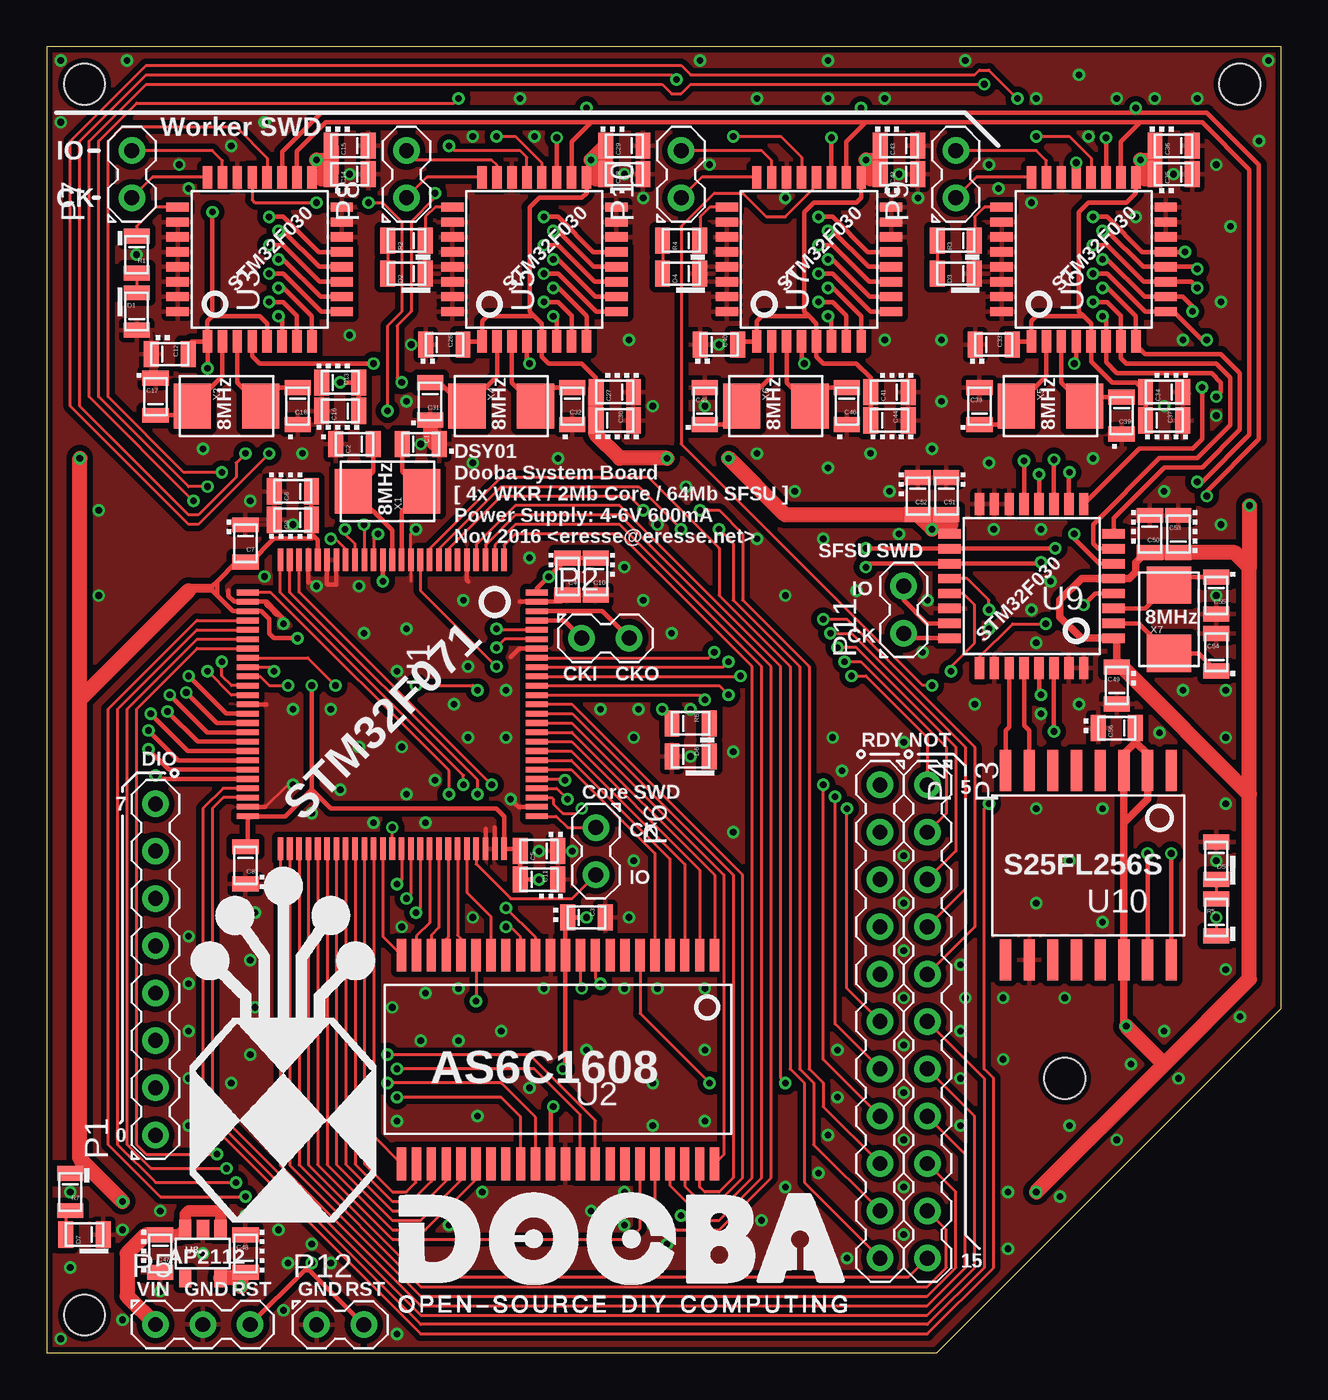
[diagram p8: board, top side]
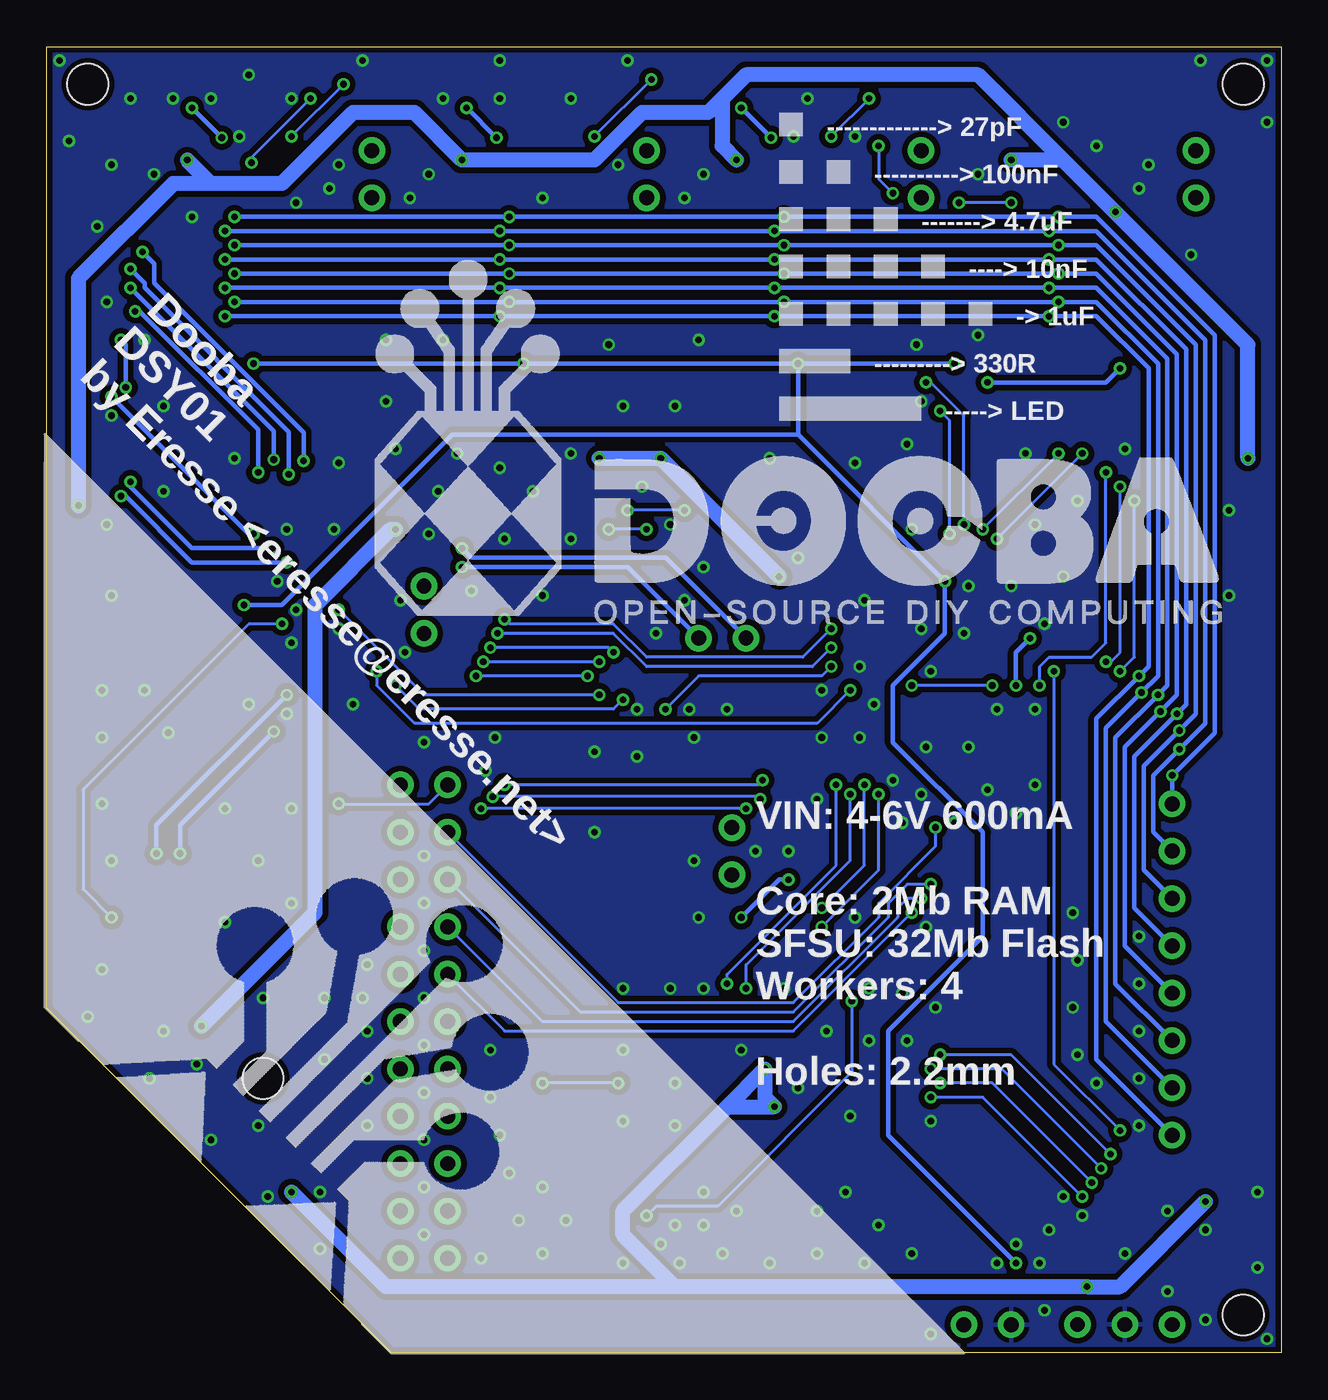
[diagram p9: board, bottom side, seen from below]

Size 66.22 x 70.09 mm. Coordinates in mm from the lower left corner, seen from the top.
Outline: 0,0 47.74,0 66.22,18.48 66.22,70.09 0,70.09 0,0
Copper layers (1*16): Top 0.035mm / dielectric 1.5mm / Bottom 0.035mm
Design rules "dooba *": minimum track width 5mil, minimum drill 12mil, track to track 6mil, track to pad 6mil, pad to pad 6mil, via to via 6mil, smd to smd 0mil, copper to edge 10mil, drill to drill 10mil, minimum pad ring 10mil, minimum via ring 6mil, stop-mask expansion 2mil, vias tented up to drill 25mil, thermal gap 10mil
Holes 2.2 mm at 2.03,2.03 2.03,68.07 64.01,68.07 54.61,14.73

### Footprints (pad centres in the part's own frame; a part is rotated, then mirrored left to right if it is on the bottom)
0805 = smd 0.8 x 1.4: 1 -1,0; 2 1,0
PIN_8 = drill 0.8 pad 1.422: 1 -8.89,0; 2 -6.35,0; 3 -3.81,0; 4 -1.27,0; 5 1.27,0; 6 3.81,0; 7 6.35,0; 8 8.89,0
PIN_2 = drill 0.8 pad 1.422: 1 -1.27,0; 2 1.27,0
PIN_11 = drill 0.8 pad 1.422: 1 -12.7,0; 2 -10.16,0; 3 -7.62,0; 4 -5.08,0; 5 -2.54,0; 6 0,0; 7 2.54,0; 8 5.08,0; 9 7.62,0; 10 10.16,0; 11 12.7,0
PIN_3 = drill 0.8 pad 1.422: 1 -2.54,0; 2 0,0; 3 2.54,0
QFP100 = smd 1.2 x 0.3: 1 -7.75,6; 2 -7.75,5.5; 3 -7.75,5; 4 -7.75,4.5; 5 -7.75,4; 6 -7.75,3.5; 7 -7.75,3; 8 -7.75,2.5; 9 -7.75,2; 10 -7.75,1.5; 11 -7.75,1; 12 -7.75,0.5; 13 -7.75,0; 14 -7.75,-0.5; 15 -7.75,-1; 16 -7.75,-1.5; 17 -7.75,-2; 18 -7.75,-2.5; 19 -7.75,-3; 20 -7.75,-3.5; 21 -7.75,-4; 22 -7.75,-4.5; 23 -7.75,-5; 24 -7.75,-5.5; 25 -7.75,-6; 51 7.75,-6; 52 7.75,-5.5; 53 7.75,-5; 54 7.75,-4.5; 55 7.75,-4; 56 7.75,-3.5; 57 7.75,-3; 58 7.75,-2.5; 59 7.75,-2; 60 7.75,-1.5; 61 7.75,-1; 62 7.75,-0.5; 63 7.75,0; 64 7.75,0.5; 65 7.75,1; 66 7.75,1.5; 67 7.75,2; 68 7.75,2.5; 69 7.75,3; 70 7.75,3.5; 71 7.75,4; 72 7.75,4.5; 73 7.75,5; 74 7.75,5.5; 75 7.75,6 | smd 0.3 x 1.2: 26 -6,-7.75; 27 -5.5,-7.75; 28 -5,-7.75; 29 -4.5,-7.75; 30 -4,-7.75; 31 -3.5,-7.75; 32 -3,-7.75; 33 -2.5,-7.75; 34 -2,-7.75; 35 -1.5,-7.75; 36 -1,-7.75; 37 -0.5,-7.75; 38 0,-7.75; 39 0.5,-7.75; 40 1,-7.75; 41 1.5,-7.75; 42 2,-7.75; 43 2.5,-7.75; 44 3,-7.75; 45 3.5,-7.75; 46 4,-7.75; 47 4.5,-7.75; 48 5,-7.75; 49 5.5,-7.75; 50 6,-7.75; 76 6,7.75; 77 5.5,7.75; 78 5,7.75; 79 4.5,7.75; 80 4,7.75; 81 3.5,7.75; 82 3,7.75; 83 2.5,7.75; 84 2,7.75; 85 1.5,7.75; 86 1,7.75; 87 0.5,7.75; 88 0,7.75; 89 -0.5,7.75; 90 -1,7.75; 91 -1.5,7.75; 92 -2,7.75; 93 -2.5,7.75; 94 -3,7.75; 95 -3.5,7.75; 96 -4,7.75; 97 -4.5,7.75; 98 -5,7.75; 99 -5.5,7.75; 100 -6,7.75
TSOPII-44 = smd 0.5 x 1.75: 1 -8.4,-5.6; 2 -7.6,-5.6; 3 -6.8,-5.6; 4 -6,-5.6; 5 -5.2,-5.6; 6 -4.4,-5.6; 7 -3.6,-5.6; 8 -2.8,-5.6; 9 -2,-5.6; 10 -1.2,-5.6; 11 -0.4,-5.6; 12 0.4,-5.6; 13 1.2,-5.6; 14 2,-5.6; 15 2.8,-5.6; 16 3.6,-5.6; 17 4.4,-5.6; 18 5.2,-5.6; 19 6,-5.6; 20 6.8,-5.6; 21 7.6,-5.6; 22 8.4,-5.6; 23 8.4,5.6; 24 7.6,5.6; 25 6.8,5.6; 26 6,5.6; 27 5.2,5.6; 28 4.4,5.6; 29 3.6,5.6; 30 2.8,5.6; 31 2,5.6; 32 1.2,5.6; 33 0.4,5.6; 34 -0.4,5.6; 35 -1.2,5.6; 36 -2,5.6; 37 -2.8,5.6; 38 -3.6,5.6; 39 -4.4,5.6; 40 -5.2,5.6; 41 -6,5.6; 42 -6.8,5.6; 43 -7.6,5.6; 44 -8.4,5.6
QFP32 = smd 1.2 x 0.5: 1 -4.4,2.8; 2 -4.4,2; 3 -4.4,1.2; 4 -4.4,0.4; 5 -4.4,-0.4; 6 -4.4,-1.2; 7 -4.4,-2; 8 -4.4,-2.8; 17 4.4,-2.8; 18 4.4,-2; 19 4.4,-1.2; 20 4.4,-0.4; 21 4.4,0.4; 22 4.4,1.2; 23 4.4,2; 24 4.4,2.8 | smd 0.5 x 1.2: 9 -2.8,-4.4; 10 -2,-4.4; 11 -1.2,-4.4; 12 -0.4,-4.4; 13 0.4,-4.4; 14 1.2,-4.4; 15 2,-4.4; 16 2.8,-4.4; 25 2.8,4.4; 26 2,4.4; 27 1.2,4.4; 28 0.4,4.4; 29 -0.4,4.4; 30 -1.2,4.4; 31 -2,4.4; 32 -2.8,4.4
SOT23-5 = smd 0.66 x 1: 1 0.95,1.315; 2 0,1.315; 3 -0.95,1.315; 4 -0.95,-1.315; 5 0.95,-1.315
SO3-016 = smd 0.6 x 2.2: 1 -4.445,-5.08; 2 -3.175,-5.08; 3 -1.905,-5.08; 4 -0.635,-5.08; 5 0.635,-5.08; 6 1.905,-5.08; 7 3.175,-5.08; 8 4.445,-5.08; 9 4.445,5.08; 10 3.175,5.08; 11 1.905,5.08; 12 0.635,5.08; 13 -0.635,5.08; 14 -1.905,5.08; 15 -3.175,5.08; 16 -4.445,5.08
XTAL_532 = smd 2 x 2.4: 1 -1.835,0; 2 1.835,0

### Placement (x,y rotation side)
C1  20.07,48.77 180 top
C2  16.51,48.77 0 top
C3  28.96,23.37 180 top
C4  27.94,41.66 90 top
C5  26.42,26.92 0 top
C6  13.21,46.23 0 top
C7  10.67,43.43 90 top
C8  10.67,26.16 90 top
C9  13.21,44.7 0 top
C10  29.46,41.66 90 top
C11  26.42,25.4 180 top
C12  6.6,53.59 180 top
C13  15.75,52.07 180 top
C14  16.26,63.25 0 top
C15  16.26,64.77 0 top
C16  15.75,50.55 0 top
C17  5.84,51.31 270 top
C18  13.46,50.8 90 top
C26  21.34,54.1 180 top
C27  30.48,51.56 0 top
C28  30.99,63.25 0 top
C29  30.99,64.77 0 top
C30  30.48,50.04 180 top
C31  20.57,51.05 90 top
C32  28.19,50.8 90 top
C33  50.8,54.1 180 top
C34  59.94,51.56 0 top
C35  60.45,63.25 0 top
C36  60.45,64.77 0 top
C37  59.94,50.04 180 top
C38  50.04,50.8 270 top
C39  57.66,50.29 90 top
C40  36.07,54.1 180 top
C41  45.21,51.56 0 top
C42  45.72,63.25 0 top
C43  45.72,64.77 0 top
C44  45.21,50.04 180 top
C45  35.31,50.8 270 top
C46  42.93,50.8 90 top
C47  6.1,5.33 90 top
C48  10.67,5.33 270 top
C49  57.4,35.81 270 top
C50  59.18,43.94 90 top
C51  48.26,45.97 90 top
C52  46.74,45.97 90 top
C53  60.71,43.94 270 top
C54  62.74,37.59 270 top
C55  62.74,40.64 90 top
C56  57.4,33.53 0 top
D1  4.83,55.88 270 top
D2  19.3,57.91 0 top
D3  48.77,57.91 0 top
D4  34.04,57.91 0 top
D5  62.74,26.42 90 top
D6  34.54,32 180 top
D7  2.03,6.35 0 top
P1  5.84,20.57 90 top
P2  29.97,38.35 0 top
P3  47.24,17.78 270 top
P4  44.7,17.78 270 top
P5  8.38,1.52 0 top
P6  29.46,26.92 270 top
P7  4.57,63.25 90 top
P8  19.3,63.25 90 top
P9  48.77,63.25 90 top
P10  34.04,63.25 90 top
P11  45.97,39.88 90 top
P12  15.75,1.51 0 top
R1  4.83,58.93 90 top
R2  19.3,59.69 0 top
R3  48.77,59.69 0 top
R4  34.04,59.69 0 top
R5  62.74,23.37 270 top
R6  34.54,33.78 180 top
R7  1.27,8.64 90 top
U1  18.54,34.8 270 top
U2  27.43,15.75 180 top
U3  11.43,58.67 90 top
U5  26.16,58.67 90 top
U6  55.63,58.67 90 top
U7  40.89,58.67 90 top
U8  8.38,5.33 0 top
U9  52.83,41.15 180 top
U10  55.88,26.16 180 top
X1  18.29,46.23 180 top
X2  9.65,50.8 0 top
X4  24.38,50.8 0 top
X5  53.85,50.8 0 top
X6  39.12,50.8 0 top
X7  60.2,39.37 90 top

### Tracks (layer width: path | path; a pad name or v marks a point on that pad's centre or on a via)
GND  (via drill 0.36)
  Top 0.152: 11.74,29.29 12.93,30.48 v13.21,30.48 | v14.48,41.15 14.3,41.33 14.05,41.33 | v19.81,44.2 19.54,43.93 U1.11 19.54,41.42 19.56,41.4
  Top 0.254: 22.61,41.4 22.54,41.47 U1.5 | 15.04,42.7 15.04,41.25 15.06,41.22 15.54,41.22 U1.19 | U1.22 14.05,41.33 | U1.27 10.8,40.31 | 10.8,40.31 11.79,40.31 | 11.79,40.31 12.04,40.06 12.04,39.9 | 12.04,39.9 11.79,40.16 11.79,40.31 | 10.8,40.31 10.06,40.31 9.75,40.61 9.75,40.89 | U1.38 11.79,34.8 | U1.49 10.8,29.29 11.74,29.29 | 25.4,37.8 U1.94 25.35,37.8 24.89,37.34 | U1.99 26.28,40.31 | 26.28,40.31 25.38,40.31 | 26.28,40.31 27.59,40.31 C4.1 | U1.77 26.28,29.29 25.32,29.29 25.15,29.46 | 24.04,28.21 U1.74 | 23.55,28.12 23.55,27.28 23.54,27.28 U1.73 | 12.04,39.9 12.32,39.62 12.45,39.62 | 12.7,39.37 12.45,39.62 | 12.45,39.62 11.94,40.13
  Top 0.813: C31.1 20.57,49.02 20.83,48.77 C1.1
  other vias: 12.95,4.83 12.7,2.29 15.24,4.83 19.81,5.33 21.59,6.86 30.99,8.64 30.99,6.86 23.37,8.64 24.89,7.62 29.21,7.62 32.51,6.86 33.27,5.84 32.26,4.83 22.35,4.83 24.89,5.33 27.43,4.83 29.97,5.33 35.31,4.83 39.62,8.89 42.93,5.08 38.35,7.11 40.89,7.11 39.62,5.33 51.56,5.59 14.22,5.84 11.68,8.38 12.45,6.6 6.1,7.62 8.38,5.33 10.67,7.37 6.1,3.3 4.06,6.6 4.06,1.78 51.56,8.64 51.31,19.05 54.61,19.05 58.17,15.49 51.31,15.75 54.86,12.19 59.94,17.27 63.25,20.57 63.25,29.46 59.69,33.27 62.74,26.42 56.64,23.11 53.09,24.13 53.09,29.21 56.64,29.21 54.86,26.42 41.4,9.65 41.91,11.68 42.42,13.72 42.42,16.26 45.97,26.67 45.97,24.13 45.97,21.59 45.97,19.05 45.97,16.51 45.97,13.97 45.97,11.43 45.97,8.89 45.97,6.35 18.8,12.45 35.31,12.45 35.31,16.26 28.96,16.26 32.51,14.48 23.11,12.7 7.62,12.19 9.91,14.48 10.92,16 11.18,18.54 10.92,21.08 11.18,23.62 7.62,14.73 7.62,17.27 7.62,19.81 7.62,22.35 24.38,17.27 25.91,14.22 32.51,12.19 32.77,19.56 35.31,19.56 22.1,16.76 22.1,19.56 18.54,18.54 20.07,16.76 20.32,19.3 19.05,22.86 22.86,23.37 26.67,19.56 30.99,19.56 31.24,23.37 31.5,26.42 28.19,26.92 24.89,29.72 26.42,26.92 20.32,28.45 19.3,29.97 20.83,30.73 17.53,28.45 14.22,28.96 15.75,30.23 19.05,32.51 15.24,34.54 16.76,32.51 13.21,34.54 21.84,34.8 24.64,33.02 22.61,33.02 24.64,35.56 22.61,36.83 19.3,38.86 25.91,42.67 22.35,40.39 16.76,41.15 18.8,36.58 17.02,38.61 12.7,39.12 30.99,42.16 32,40.39 33.53,38.61 39.62,40.64 32.77,44.45 38.1,43.69 34.29,46.48 43.43,40.89 41.66,43.69 47.24,40.39 50.55,38.86 53.09,38.1 53.85,41.4 53.34,44.2 50.8,44.2 45.72,43.94 40.13,46.23 38.1,48.26 44.2,48.26 45.21,46.23 41.91,47.5 56.13,48.01 59.94,46.23 62.99,44.45 49.78,34.8 55.37,34.8 63.25,33.02 60.96,35.56 63.25,35.56 53.34,34.29 46.99,37.59 45.97,32.77 42.67,31.24 42.16,33.02 36.83,27.94 36.83,32.26 31.5,33.02 34.54,32 49.02,12.19 49.02,14.73 49.02,17.27 49.02,20.83 49.28,19.05 10.92,45.72 11.68,41.66 13.72,48.26 8.38,48.51 22.86,47.75 27.43,48.01 32.51,50.8 35.31,50.8 31.24,54.36 16.26,54.61 19.56,54.1 2.79,45.21 2.79,40.64 4.83,58.93 11.68,66.04 25.4,67.31 26.16,65.28 32,61.98 38.1,67.31 41.91,67.31 46.74,61.98 52.83,61.72 55.88,65.28 44.96,67.31 62.74,63.75 63.5,60.45 58.42,60.96 62.99,56.39 60.96,54.36 59.94,50.8 62.74,50.29 50.55,47.75 47.5,48.51 48.01,51.05 44.96,54.36 48.01,54.36 62.74,40.64 36.07,54.1 39.62,61.98 20.07,48.77 19.3,51.05 13.21,44.45 61.72,67.31 59.44,67.31 57.4,67.31 53.09,67.31 65.02,65.02 64.01,18.03 57.4,11.43 60.71,14.73 54.36,8.38 16.26,63.25 30.99,63.25 45.72,63.25 60.45,63.25 7.62,62.48 51.05,62.48 50.55,63.75 22.86,65.28 52.83,39.88 29.72,34.54 31.75,34.54 9.91,64.77 7.11,63.75 35.56,63.75 34.54,34.54 4.32,69.34 0.76,66.04 0.76,69.34 55.37,68.58 49.28,69.34 35.05,69.34 41.91,69.34 0.76,0.76 18.8,1.02 1.27,8.64 1.27,4.57 65.53,69.34
  pour Top (isolate 0.305): 0,70.1 66.29,70.1 66.29,0 0,0
  pour Bottom (isolate 0.305): 0,70.1 66.29,70.1 66.29,0 0,0
N$1
  Top 0.254: U1.12 19.04,45.15 X1.1 19.07,47.28 C1.2
N$2
  Top 0.254: U1.13 18.54,44.14 X1.2 17.51,47.28 C2.2
N$3
  Top 0.152: U1.55 14.54,10.1 18.54,6.1 31.24,6.1 31.83,6.69 U2.39
N$4  (via drill 0.36)
  Top 0.152: U1.32 8.08,37.8 4.83,34.54 4.83,11.18 5.33,10.67 v9.14,10.67 | U2.36 29.43,12.48 25.91,16 v18.29,16
  Bottom 0.152: v9.14,10.67 14.48,16 v18.29,16
N$5  (via drill 0.36)
  Top 0.152: U1.31 8.07,38.3 4.32,34.54 4.32,11.18 5.59,9.91 v9.65,9.91 | U2.35 28.63,12.77 26.16,15.24 v18.8,15.24
  Bottom 0.152: v9.65,9.91 14.99,15.24 v18.8,15.24
N$6  (via drill 0.36)
  Top 0.152: U1.30 8.06,38.8 3.81,34.54 3.81,11.18 5.84,9.14 v10.16,9.14 | U2.32 26.23,12.63 24.38,14.48 v18.29,14.48
  Bottom 0.152: v10.16,9.14 15.49,14.48 v18.29,14.48
N$7  (via drill 0.36)
  Top 0.152: U1.29 8.06,39.3 3.3,34.54 3.3,11.18 6.1,8.38 v10.67,8.38 | U2.31 25.43,12.67 24.38,13.72 v18.8,13.72
  Bottom 0.152: v10.67,8.38 16,13.72 v18.8,13.72
N$8  (via drill 0.36)
  Top 0.152: U2.14 25.43,22.32 24.89,22.86 v24.64,22.86 | v21.59,29.97 21.59,31.24 12.03,40.8 U1.26
  Bottom 0.152: v24.64,22.86 21.59,25.91 v21.59,29.97
N$9  (via drill 0.36)
  Top 0.152: U2.13 26.23,22.28 v24.64,23.88 | v22.35,30.48 22.35,30.99 12.54,40.8 U1.25
  Bottom 0.152: v24.64,23.88 22.35,26.16 v22.35,30.48
N$10  (via drill 0.36)
  Top 0.152: U2.10 28.63,19.63 v28.7,19.56 | v23.11,29.97 23.11,30.73 13.04,40.81 U1.24
  Bottom 0.152: v28.7,19.56 28.7,20.83 23.11,26.42 v23.11,29.97
N$11  (via drill 0.36)
  Top 0.152: U2.9 29.43,20.1 v29.72,19.81 | v23.88,30.48 13.54,40.81 U1.23
  Bottom 0.152: v29.72,19.81 29.72,20.32 23.88,26.16 v23.88,30.48
N$12
  Top 0.152: U1.56 15.04,10.1 18.54,6.6 20.32,6.6 23.03,9.32 U2.28
N$13
  Top 0.152: U1.57 15.54,10.11 18.54,7.11 20.07,7.11 22.23,9.28 U2.27
N$14
  Top 0.152: U1.58 16.04,10.12 18.54,7.62 19.81,7.62 21.43,9.24 U2.26
N$15
  Top 0.152: U1.59 16.54,10.13 18.54,8.13 19.56,8.13 20.63,9.2 U2.25
N$16
  Top 0.152: U1.60 17.04,10.14 18.54,8.64 19.3,8.64 19.81,9.14 19.81,10.13 U2.24
N$17
  Top 0.152: U1.61 17.54,11.64 U2.23
N$18
  Top 0.152: U1.62 18.04,22.34 U2.22
N$19
  Top 0.152: U1.67 20.54,23.08 19.83,22.37 U2.21
N$20
  Top 0.152: U1.68 21.04,22.82 20.63,22.41 U2.20
N$21
  Top 0.152: U1.69 21.54,22.3 21.34,22.1 21.34,21.44 U2.19
N$22
  Top 0.152: U1.70 22.04,22.41 22.23,22.22 U2.18
N$23
  Top 0.152: U1.71 22.54,24.7 23.83,23.41 U2.16
N$24
  Top 0.152: U1.81 28.14,31.3 32.63,26.8 U2.5
N$25
  Top 0.152: U1.82 28.15,31.8 33.43,26.51 U2.4
N$26
  Top 0.152: U1.83 28.15,32.3 34.23,26.22 U2.3
N$27
  Top 0.152: U1.84 28.16,32.8 35.03,25.93 U2.2
N$28
  Top 0.152: U1.85 28.17,33.3 35.83,25.64 U2.1
N$29
  Top 0.152: U1.86 28.18,33.8 36.32,25.65 36.32,10.64 U2.44
N$30
  Top 0.152: U1.87 28.19,34.3 36.83,25.65 36.83,9.4 36.07,8.64 35.31,8.64 35.03,8.91 U2.43
N$31
  Top 0.152: U2.42 34.23,8.95 35.05,8.13 36.07,8.13 37.34,9.4 37.34,25.65 28.19,34.8 U1.88
N$32
  Top 0.254: U3.2 9.43,52.41 X2.1 7.32,50.31 C17.2
N$33
  Top 0.254: U3.3 10.23,52.06 X2.2 12.49,51.8 C18.2
N$34
  Top 0.61: C47.2 7.12,6.33 U8.3 7.43,7.43 7.62,7.62 9.14,7.62 9.33,7.43 U8.1
  Top 0.813: C47.2 5.32,6.33 4.32,5.33 4.32,3.05 P5.1
N$35  (via drill 0.36)
  Top 0.254: P5.3 13.84,4.45 | 13.84,4.45 v14.22,4.83 14.08,4.69 14.08,4.45 | v55.63,40.13 56.24,40.75 U9.4 | U1.14 18.04,41.41 v18.03,41.4 | v55.12,53.09 55.23,53.19 U6.4 | U3.4 11.03,53.49 11.43,53.09 v17.53,53.09 | v25.91,53.09 25.76,53.23 U5.4 | U7.4 40.49,53.23 v40.64,53.09 | P12.2 14.08,4.45 | 14.08,4.45 13.84,4.45
  Bottom 0.254: v14.22,4.83 21.08,11.68 21.08,17.27 16,22.35 16,27.94 20.83,32.77 20.83,35.81 18.03,38.61 v18.03,41.4 25.91,49.28 | 25.91,49.28 44.45,49.28 53.59,40.13 v55.63,40.13 | v55.12,53.09 v40.64,53.09 v25.91,53.09 | v17.53,53.09 v25.91,53.09 | v25.91,53.09 25.91,49.28
N$36
  Top 0.152: U2.41 33.43,8.99 34.8,7.62 36.07,7.62 37.85,9.4 37.85,36.83 30.73,43.94 25.15,43.94 24.54,43.34 U1.1
N$37  (via drill 0.36)
  Top 0.152: U1.2 24.04,43.35 25.15,44.45 30.73,44.45 38.35,36.83 38.35,9.4 36.07,7.11 34.29,7.11 v34.04,7.37 | U2.17 v23.03,18.88
  Bottom 0.152: v34.04,7.37 33.53,7.87 30.23,7.87 23.03,15.07 v23.03,18.88
N$38
  Top 0.152: U2.40 32.63,7.75 33.78,6.6 36.07,6.6 38.86,9.4 38.86,36.83 30.73,44.96 25.15,44.96 23.54,43.35 U1.3
N$39  (via drill 0.36)
  Top 0.152: U2.6 31.83,18.21 v35.56,14.48 | v39.62,14.48 39.37,14.73 39.37,36.83 30.73,45.47 25.15,45.47 23.04,43.36 U1.4
  Bottom 0.152: v35.56,14.48 v39.62,14.48
N$40
  Top 0.152: U1.76 27.34,28.8 27.94,28.19 P6.1
N$41
  Top 0.152: U1.72 23.04,26.23 24.89,24.38 28.19,24.38 P6.2
N$42
  Top 0.152: U3.23 9.43,63.98 8.89,64.52 P7.2
N$43  (via drill 0.36)
  Top 0.254: U9.29 53.23,35.41 v53.34,35.31 | U10.16 v60.33,26.8
  Bottom 0.254: v53.34,35.31 60.33,28.32 v60.33,26.8
N$44  (via drill 0.36)
  Top 0.152: U3.21 11.03,61.87 11.18,61.72 v14.48,61.72 | U1.15 17.54,43.7 v17.78,43.94 | v18.29,50.55 18.29,55.12 19.05,55.88 19.05,60.71 18.03,61.72 v17.27,61.72
  Bottom 0.152: v14.48,61.72 v17.27,61.72 | v17.78,43.94 17.78,50.04 v18.29,50.55
N$45
  Top 0.152: U7.24 35.13,63.07 P10.1
N$46
  Top 0.152: U5.23 24.16,63.72 23.88,64.01 19.81,64.01 P8.2
N$47
  Top 0.152: U6.24 49.87,63.07 P9.1
N$48
  Top 0.152: U6.23 53.63,63.98 53.09,64.52 P9.2
N$49
  Top 0.152: U5.24 20.4,63.07 P8.1
N$50
  Top 0.152: U7.23 38.89,63.98 38.35,64.52 P10.2
N$51
  Top 0.152: U3.24 5.67,63.07 P7.1
N$52
  Top 0.254: U9.23 47.21,39.15 45.97,40.39 P11.2
N$53
  Top 0.254: U9.24 46.23,38.35 P11.1
N$54
  Top 0.152: R1.1 D1.1
N$55  (via drill 0.36)
  Top 0.254: v56.13,56.39 56.9,56.39 57.63,55.66 U6.7 57.63,53.37 57.91,53.09 62.74,53.09 63.5,52.32 63.5,49.78 61.72,48.01 59.69,48.01 56.13,44.45 56.13,43.43 56.42,43.15 U9.7 | U7.7 42.89,55.66 42.16,56.39 v41.4,56.39 | U5.7 28.16,55.66 27.43,56.39 v26.67,56.39 | U3.7 13.43,55.66 12.7,56.39 v11.94,56.39 | U1.40 9.13,33.8 v7.49,35.43
  Bottom 0.254: v56.13,56.39 v41.4,56.39 v26.67,56.39 v11.94,56.39 9.91,56.39 6.6,53.09 6.6,36.32 v7.49,35.43 9.4,33.53 9.4,17.78 P1.2
N$56
  Top 0.152: U3.25 5.85,61.47 4.83,60.45 R1.2
N$57  (via drill 0.36)
  Top 0.152: U1.96 24.19,38.8 v24.13,38.86 | v41.66,39.37 42.93,39.37 49.78,32.51 49.78,22.86 P3.5
  Bottom 0.152: v24.13,38.86 25.65,37.34 34.04,37.34 35.81,39.12 41.4,39.12 v41.66,39.37
N$58  (via drill 0.36)
  Top 0.152: U1.95 24.58,38.3 v24.13,37.85 | v42.04,38.61 43.18,38.61 49.28,32.51 49.28,24.89 P3.4
  Bottom 0.152: v42.04,38.61 35.81,38.61 34.04,36.83 25.15,36.83 v24.13,37.85
N$59  (via drill 0.36)
  Top 0.152: U1.93 35.52,37.3 v35.81,37.59 | v42.42,37.85 43.43,37.85 48.77,32.51 48.77,26.92 P3.3
  Bottom 0.152: v35.81,37.59 36.07,37.85 v42.42,37.85
N$60  (via drill 0.36)
  Top 0.152: U1.92 36.29,36.8 v36.58,37.08 | v42.8,37.08 43.69,37.08 48.26,32.51 48.26,28.96 P3.2
  Bottom 0.152: 42.67,37.08 v42.8,37.08 v36.58,37.08
N$61  (via drill 0.36)
  Top 0.152: U1.91 37.19,36.3 v37.21,36.32 | P3.1 47.24,33.02 43.94,36.32 v43.18,36.32
  Bottom 0.152: v37.21,36.32 v43.18,36.32
N$62
  Top 0.152: R2.1 D2.1
N$63  (via drill 0.36)
  Top 0.254: v56.64,57.15 56.9,57.15 58.43,55.62 U6.8 58.43,54.1 58.93,53.59 62.99,53.59 64.01,52.58 64.01,49.53 61.98,47.5 59.94,47.5 57.23,44.79 U9.8 | U7.8 43.69,55.62 42.16,57.15 v41.91,57.15 | U5.8 28.96,55.62 27.43,57.15 v27.18,57.15 | U3.8 14.23,55.62 12.7,57.15 v12.45,57.15 | U1.41 8.61,33.3 v6.6,35.31
  Bottom 0.254: v56.64,57.15 v41.91,57.15 v27.18,57.15 v12.45,57.15 9.91,57.15 6.1,53.34 6.1,35.81 v6.6,35.31 8.89,33.02 8.89,19.81 P1.3
N$64
  Top 0.152: U1.47 9.47,30.3 8.38,29.21 8.38,13.21 20.07,1.52 47.24,1.52 50.29,4.57 50.29,14.73 P3.6
N$65
  Top 0.152: U1.48 9.48,29.8 8.89,29.21 8.89,13.21 20.07,2.03 47.24,2.03 49.78,4.57 49.78,12.7 P3.7
N$66
  Top 0.152: U1.51 12.54,10.06 20.07,2.54 47.24,2.54 49.28,4.57 49.28,10.67 P3.8
N$67
  Top 0.152: U1.52 13.04,10.07 20.07,3.05 47.24,3.05 48.77,4.57 48.77,8.64 P3.9
N$68
  Top 0.152: U1.53 13.54,10.08 20.07,3.56 47.24,3.56 48.26,4.57 48.26,6.6 P3.10
N$69
  Top 0.152: U1.54 14.04,10.09 20.07,4.06 46.23,4.06 P3.11
N$70
  Top 0.152: U5.25 20.83,61.47 20.32,60.96 20.32,59.71 R2.2
N$71  (via drill 0.36)
  Top 0.254: v56.13,57.91 56.9,57.91 58.93,55.87 U6.9 60.46,55.87 61.98,54.36 v62.23,54.36 | U7.9 44.2,55.87 42.16,57.91 v41.4,57.91 | U5.9 29.47,55.87 27.43,57.91 v26.67,57.91 | U3.9 14.74,55.87 12.7,57.91 v11.94,57.91 | U1.42 8.1,32.8 v6.48,34.42 | U9.9 58.6,48.51 61.47,48.51 61.98,49.02 v61.98,51.82
  Bottom 0.254: v56.13,57.91 v41.4,57.91 v26.67,57.91 v11.94,57.91 9.91,57.91 5.59,53.59 5.59,35.31 v6.48,34.42 8.38,32.51 8.38,21.84 P1.4 | v61.98,51.82 61.98,54.1 v62.23,54.36
N$72  (via drill 0.36)
  Top 0.254: v56.64,58.67 56.9,58.67 58.9,56.67 U6.10 60.93,56.67 61.47,56.13 v61.47,55.88 | U7.10 44.16,56.67 42.16,58.67 v41.91,58.67 | U5.10 29.43,56.67 27.43,58.67 v27.18,58.67 | U3.10 14.7,56.67 12.7,58.67 v12.45,58.67 | U1.43 7.58,32.3 v5.59,34.29 | v54.86,47.24 54.83,47.21 U9.10
  Bottom 0.254: v56.64,58.67 v41.91,58.67 v27.18,58.67 v12.45,58.67 9.91,58.67 5.08,53.85 5.08,34.8 v5.59,34.29 7.87,32 7.87,23.88 P1.5 | v54.86,47.24 54.86,49.53 61.21,55.88 v61.47,55.88
N$73  (via drill 0.36)
  Top 0.254: v56.13,59.44 56.9,59.44 58.86,57.47 U6.11 61.4,57.47 v61.72,57.15 | U7.11 44.13,57.47 42.16,59.44 v41.4,59.44 | U5.11 29.39,57.47 27.43,59.44 v26.67,59.44 | U3.11 14.66,57.47 12.7,59.44 v11.94,59.44 | U1.44 7.06,31.8 v5.46,33.4 | v54.03,47.94 U9.11
  Bottom 0.254: v56.13,59.44 v41.4,59.44 v26.67,59.44 v11.94,59.44 9.91,59.44 4.57,54.1 4.57,34.29 v5.46,33.4 7.37,31.5 7.37,25.91 P1.6 | v54.03,47.94 54.03,49.46 v61.72,57.15
N$74
  Top 0.152: R3.1 D3.1
N$75  (via drill 0.36)
  Top 0.152: U1.34 11.97,36.8 v12.19,36.58 | v50.55,29.46 50.29,29.21 50.29,15.24 50.8,14.73 50.8,4.57 47.24,1.02 20.07,1.02 9.14,11.94 v8.64,11.94
  Bottom 0.152: v50.55,29.46 45.72,29.46 P4.1 | v12.19,36.58 12.19,15.49 v8.64,11.94
N$76  (via drill 0.36)
  Top 0.152: U1.63 v18.54,28.19
  Bottom 0.152: v18.54,28.19 18.54,27.18 21.59,24.13 21.59,23.37 26.16,18.8 35.56,18.8 P4.2
N$77  (via drill 0.36)
  Top 0.152: U1.64 19.04,25.39 v18.8,25.15
  Bottom 0.152: v18.8,25.15 20.07,25.15 21.08,24.13 21.08,23.37 26.16,18.29 37.59,18.29 P4.3
N$78  (via drill 0.36)
  Top 0.152: U1.65 19.54,24.62 v19.3,24.38
  Bottom 0.152: v19.3,24.38 20.07,24.38 20.57,23.88 20.57,23.37 26.16,17.78 39.62,17.78 P4.4
N$79  (via drill 0.36)
  Top 0.152: U1.66 20.04,23.85 v19.81,23.62
  Bottom 0.152: v19.81,23.62 26.16,17.27 41.66,17.27 P4.5
N$80  (via drill 0.36)
  Top 0.152: U1.80 27.75,30.8 v27.81,30.73 | P4.8 41.66,15.75 v41.66,30.48
  Bottom 0.152: v27.81,30.73 28.07,30.48 v41.66,30.48
N$81  (via drill 0.36)
  Top 0.152: U1.79 27.36,30.3 v27.94,29.72 | P4.7 42.29,17.65 v42.29,29.85
  Bottom 0.152: v27.94,29.72 28.07,29.85 v42.29,29.85
N$82  (via drill 0.36)
  Top 0.152: U1.78 27.1,29.8 27.18,29.72 27.18,29.46 27.69,28.96 28.45,28.96 v28.7,29.21 | P4.6 42.93,19.56 v42.93,29.21
  Bottom 0.152: v28.7,29.21 v42.93,29.21
N$83  (via drill 0.36)
  Top 0.152: U1.7 21.54,43.13 24.38,45.97 31.24,45.97 v32,45.21 | v35.05,45.21 36.07,45.21 37.34,43.94 37.34,40.39 40.89,36.83 40.89,15.24 41.66,14.48 41.66,13.21 P4.9
  Bottom 0.152: v32,45.21 v35.05,45.21
N$84  (via drill 0.36)
  Top 0.152: U1.8 21.04,43.14 24.38,46.48 31.75,46.48 v34.04,44.2 | v36.07,44.2 36.83,43.43 36.83,40.39 40.39,36.83 40.39,15.24 41.15,14.48 41.15,11.18 P4.10
  Bottom 0.152: v34.04,44.2 v36.07,44.2
N$85
  Top 0.152: U1.9 20.54,43.15 24.38,46.99 32.26,46.99 36.07,43.18 36.07,40.64 39.88,36.83 39.88,15.24 40.64,14.48 40.64,9.14 P4.11
N$86  (via drill 0.36)
  Top 0.152: U1.35 11.45,36.3 11.94,35.81 v12.95,35.81 | U3.20 11.83,64.12 10.16,65.79 4.06,65.79 3.3,65.02 3.3,51.31 7.37,47.24 v9.4,47.24
  Bottom 0.152: v12.95,35.81 12.95,36.83 12.45,37.34 10.16,37.34 9.4,38.1 v9.4,47.24
N$87
  Top 0.152: U6.25 50.3,61.47 49.78,60.96 49.78,59.71 R3.2
N$88
  Top 0.152: R4.1 D4.1
N$89
  Top 0.152: U7.25 35.57,61.47 35.05,60.96 35.05,59.71 R4.2
N$90
  Top 0.254: U5.2 24.16,52.41 X4.1 22.35,50.8 21.08,52.07 20.59,52.07 C31.2
N$91
  Top 0.254: U5.3 24.96,52.06 X4.2 27.22,51.8 C32.2
N$92
  Top 0.152: D5.1 R5.1
N$93  (via drill 0.36)
  Top 0.254: v56.64,60.2 56.9,60.2 58.82,58.27 U6.12 61.61,58.27 v61.72,58.17 | U7.12 44.09,58.27 42.16,60.2 v41.91,60.2 | U5.12 29.36,58.27 27.43,60.2 v27.18,60.2 | U3.12 14.62,58.27 12.7,60.2 v12.45,60.2 | U1.45 6.55,31.3 v5.46,32.39 | U9.12 v53.23,47.14
  Bottom 0.254: v56.64,60.2 v41.91,60.2 v27.18,60.2 v12.45,60.2 9.91,60.2 4.06,54.36 4.06,33.78 v5.46,32.39 6.86,30.99 6.86,27.94 P1.7 | v53.23,47.14 53.23,49.42 60.96,57.15 60.96,57.4 v61.72,58.17
N$94  (via drill 0.36)
  Top 0.254: v56.13,60.96 56.9,60.96 58.78,59.07 U6.13 v61.07,59.07 | U7.13 44.05,59.07 42.16,60.96 v41.4,60.96 | U5.13 29.32,59.07 27.43,60.96 v26.67,60.96 | U3.13 14.59,59.07 12.7,60.96 v11.94,60.96 | U1.46 6.03,30.8 v5.84,30.99 | U9.13 v52.43,47.86
  Bottom 0.254: v56.13,60.96 v41.4,60.96 v26.67,60.96 v11.94,60.96 9.91,60.96 3.56,54.61 3.56,33.27 v5.84,30.99 P1.8 | v52.43,47.86 52.43,49.38 60.45,57.4 60.45,58.46 v61.07,59.07
N$95  (via drill 0.36)
  Top 0.254: U3.19 12.63,64.45 14.73,66.55 29.21,66.55 | 29.21,66.55 43.94,66.55 | 43.94,66.55 58.67,66.55 | U5.19 v27.36,65.21 | 29.21,66.55 v28.96,66.8 | U7.19 v42.09,65.21 | 43.94,66.55 v43.69,66.8 | U6.19 v56.83,65.21 | 58.67,66.55 v58.42,66.8 | U1.98 29.8,39.8 P2.2 | v43.94,42.16 44.13,42.35 U9.19 53.27,42.35 v53.34,42.42 | v62.23,45.97 62.23,46.23 65.02,49.02 65.02,63.75 62.23,66.55 58.67,66.55
  Bottom 0.254: v27.36,65.21 v28.96,66.8 | v42.09,65.21 v43.69,66.8 | v56.83,65.21 v58.42,66.8 | v43.94,42.16 35.05,42.16 P2.2 | v62.23,45.97 61.98,45.97 58.42,42.42 v53.34,42.42
N$96  (via drill 0.36)
  Top 0.254: U3.18 13.43,64.48 14.99,66.04 29.21,66.04 | 29.21,66.04 43.94,66.04 | 43.94,66.04 58.67,66.04 | U5.18 28.16,64.99 29.21,66.04 | U7.18 42.89,64.99 43.94,66.04 | U6.18 57.63,64.99 58.67,66.04 | U1.97 27.76,39.3 P2.1 | v43.94,43.18 43.97,43.15 U9.18 54.07,43.15 v54.1,43.18 | v61.72,46.74 61.98,46.74 64.52,49.28 64.52,63.5 61.98,66.04 58.67,66.04
  Bottom 0.254: v43.94,43.18 43.43,42.67 33.02,42.67 P2.1 | v54.1,43.18 58.42,43.18 61.72,46.48 v61.72,46.74
N$97  (via drill 0.36)
  Top 0.254: v56.64,55.63 56.83,55.44 U6.6 56.83,53.16 57.4,52.58 62.48,52.58 62.99,52.07 62.99,51.56 v62.74,51.31 | U7.6 42.09,55.44 v41.91,55.63 | U5.6 27.36,55.44 v27.18,55.63 | U3.6 12.63,55.44 v12.45,55.63 | U1.39 9.64,34.3 v7.62,36.32 | U9.6 56.46,42.35 55.12,43.69 v55.12,43.94
  Bottom 0.254: v56.64,55.63 v41.91,55.63 v27.18,55.63 v12.45,55.63 9.91,55.63 7.11,52.83 7.11,36.83 v7.62,36.32 9.91,34.04 9.91,15.75 P1.1 | v55.12,43.94 55.37,43.94 v62.74,51.31
N$98
  Top 0.254: U9.2 58.59,39.15 X7.1 61.8,37.53 C54.2
N$99
  Top 0.254: U9.3 58.94,39.95 X7.2 60.63,41.64 C55.2
N$100  (via drill 0.36)
  Top 0.152: U1.90 36.08,35.8 v36.58,35.31 | v50.55,39.88 50.55,40.39 49.38,41.55 U9.20
  Bottom 0.152: v36.58,35.31 45.97,35.31 v50.55,39.88
N$101  (via drill 0.36)
  Top 0.152: U1.33 14.01,37.3 v15.49,35.81 | v19.81,35.81 22.86,35.81 v23.11,35.56 | U9.21 49.17,40.75 49.78,40.13 49.78,38.1 48.51,36.83 v48.51,36.58
  Bottom 0.152: v15.49,35.81 v19.81,35.81 | v23.11,35.56 24.89,33.78 46.48,33.78 48.51,35.81 v48.51,36.58
N$102  (via drill 0.36)
  Top 0.152: U1.36 9.92,35.8 9.4,36.32 v9.4,37.08 | v8.64,46.48 7.62,46.48 2.79,51.31 2.79,65.02 4.83,67.06 21.84,67.06 v22.1,67.31 | v24.13,65.28 25.15,65.28 26.56,63.86 U5.20
  Bottom 0.152: v9.4,37.08 9.14,37.08 8.64,37.59 v8.64,46.48 | v22.1,67.31 v24.13,65.28
N$103  (via drill 0.36)
  Top 0.152: U5.21 25.76,64.15 25.4,64.52 21.84,64.52 v21.59,64.77 | v20.83,62.23 20.83,61.98 19.56,60.71 19.56,55.88 18.8,55.12 18.8,52.32 v19.05,52.07 | U1.16 17.04,44.43 v17.02,44.45
  Bottom 0.152: v21.59,64.77 21.59,62.99 v20.83,62.23 | v17.02,44.45 17.02,50.29 18.8,52.07 v19.05,52.07
N$104
  Top 0.254: U6.2 53.63,52.41 X5.1 51.01,49.8 C38.2
N$105
  Top 0.254: U6.3 54.43,52.06 X5.2 56.18,51.29 C39.2
N$106  (via drill 0.36)
  Top 0.254: U9.30 v54.03,33.34 | U10.15 v59.06,26.8
  Bottom 0.254: v54.03,33.34 59.06,28.32 v59.06,26.8
N$107
  Top 0.254: U10.7 52.7,33.4 52.43,33.67 U9.28
N$108
  Top 0.254: U10.8 51.44,33.4 51.63,33.6 U9.27
N$109  (via drill 0.36)
  Top 0.152: v62.74,23.37 R5.2 | U9.25 50.03,37.33 51.82,39.12 v53.59,39.12
  Bottom 0.152: v53.59,39.12 55.37,39.12 64.26,30.23 64.26,24.89 v62.74,23.37
N$110
  Top 0.152: R6.1 D6.1
N$111  (via drill 0.36)
  Top 0.152: U1.10 20.04,40.92 v24.13,36.83 | v33.02,34.54 33.54,34.02 R6.2
  Bottom 0.152: v24.13,36.83 24.64,36.32 31.24,36.32 v33.02,34.54
N$112
  Top 0.152: R7.1 1.03,7.4 D7.1
N$116  (via drill 0.36)
  Top 0.152: U1.37 9.91,35.3 v8.64,36.58 | v7.87,45.72 2.29,51.31 2.29,65.02 5.33,68.07 33.02,68.07 33.53,67.56 34.04,67.56 34.54,68.07 v50.29,68.07 | v53.09,65.28 54.86,65.28 56.03,64.12 U6.20
  Bottom 0.152: v8.64,36.58 7.87,37.34 v7.87,45.72 | v50.29,68.07 v53.09,65.28
N$117  (via drill 0.36)
  Top 0.152: U1.17 16.54,43.4 16,43.94 v16,44.2 | v11.94,48.26 8.13,44.45 7.62,44.45 1.27,50.8 1.27,65.02 5.33,69.09 34.04,69.09 34.54,68.58 49.78,68.58 50.04,68.83 50.55,68.83 v52.07,67.31 | U6.21 v55.23,63.86
  Bottom 0.152: v16,44.2 v11.94,48.26 | v52.07,67.31 55.23,64.15 v55.23,63.86
N$118
  Top 0.254: U7.2 38.89,52.41 X6.1 36.28,49.8 C45.2
N$119
  Top 0.254: U7.3 39.69,52.06 X6.2 41.95,51.8 C46.2
N$130  (via drill 0.36)
  Top 0.152: U1.89 35.06,35.3 v35.31,35.05 | v47.5,35.81 46.99,35.81 34.04,48.77 34.04,60.45 35.81,62.23 37.34,62.23 38.61,60.96 39.62,60.96 41.29,62.63 U7.20
  Bottom 0.152: v35.31,35.05 35.81,34.54 46.23,34.54 v47.5,35.81
N$131  (via drill 0.36)
  Top 0.152: U1.18 16.04,43.14 15.49,43.69 v15.24,43.69 | v10.67,48.26 10.16,47.75 10.16,46.99 8.13,44.96 7.62,44.96 1.78,50.8 1.78,65.02 5.33,68.58 33.53,68.58 v33.78,68.33 | v36.83,65.28 39.37,65.28 40.49,64.15 U7.21
  Bottom 0.152: v15.24,43.69 v10.67,48.26 | v33.78,68.33 v36.83,65.28
VCC  (via drill 0.36)
  Top 0.152: 29.46,62.99 29.38,63.07 U5.17 | 14.73,62.99 14.65,63.07 U3.17 | 44.2,62.99 44.11,63.07 U7.17 | U9.17 48.18,44.2 v47.5,44.2 | 1.78,10.41 1.78,10.14 R7.2
  Top 0.254: 29.82,63.07 C28.1 | 15.08,63.07 C14.1 | 44.55,63.07 C42.1 | C36.1 59.45,64.01 C35.1 59.28,63.07 U6.17 58.43,62.24 57.91,61.72 55.88,61.72 55.37,61.21 55.37,55.88 55.63,55.63 | 55.63,55.63 56.03,55.23 U6.5 56.03,53.19 57.15,52.07 58.44,52.07 C34.1 C37.2 | 55.63,55.63 53.09,55.63 52.83,55.37 U6.1 51.97,54.27 C33.1 | 40.89,55.63 41.29,55.23 U7.5 41.29,53.45 41.66,53.09 43.43,53.09 44.2,52.32 44.2,51.58 C41.1 C44.2 | 40.89,55.63 38.35,55.63 38.09,55.37 U7.1 37.24,54.27 C40.1 | 26.16,55.63 26.56,55.23 U5.5 26.56,53.45 26.92,53.09 28.7,53.09 29.46,52.32 29.46,51.82 29.46,51.58 C27.1 C30.2 | 26.16,55.63 23.62,55.63 23.36,55.37 U5.1 22.51,54.27 C26.1 | U3.5 11.83,55.23 11.43,55.63 8.89,55.63 | 8.89,55.63 8.63,55.37 U3.1 | v8.89,61.21 8.89,55.63 | U5.17 28.96,62.24 28.7,61.98 26.42,61.98 25.91,61.47 25.91,55.88 26.16,55.63 | U7.17 43.69,61.98 43.43,61.72 41.15,61.72 40.64,61.21 40.64,55.88 40.89,55.63 | U3.1 7.78,54.27 C12.1 | v15.75,52.07 C13.1 C16.2 | v8.64,52.83 U3.1 | U1.21 14.54,43.62 14.35,43.81 | 14.35,43.81 14.22,43.94 14.22,44.69 C9.2 C6.2 | C7.1 10.94,42.43 12.19,43.69 14.22,43.69 14.35,43.81 | C7.1 10.67,42.16 | 14.22,30.23 12.8,28.8 U1.50 10.79,27.29 C8.2 | 14.22,30.23 v14.22,35.81 | v13.46,38.35 12.19,38.35 11.94,38.61 11.94,39.37 11.51,39.8 U1.28 9.99,39.8 9.14,40.64 | 9.14,40.64 9.14,41.4 | 9.14,41.4 10.18,42.43 C7.1 | 14.22,30.23 15.24,29.21 24.13,29.21 24.54,28.8 U1.75 25.29,27.05 C5.1 C11.2 v26.42,25.4 | v28.96,23.37 C3.2 27.83,23.24 U2.11 27.83,15.39 v27.69,15.24 | v27.18,13.21 27.03,13.06 U2.33 | 9.14,40.64 8.89,40.89 | 8.89,40.89 7.62,40.89 | 8.89,41.15 7.62,41.15
  Top 0.254: 8.89,40.89 8.89,41.15 | 9.14,41.4 8.89,41.15 | U1.100 26.29,41.01 v26.93,41.65 C4.2 C10.2
  Top 0.406: v57.91,17.53 57.79,17.65 U10.14 57.79,28.45 | 57.79,28.45 U10.3 57.79,32.13 58.4,32.75 C56.2 | 57.79,28.45 59.06,29.72 U10.2 59.06,32.13 58.42,32.77 58.42,33.27 | C50.1 58.94,42.94 58.42,42.42 58.42,41.91 58.06,41.55 U9.5 55.52,41.55 54.36,40.39 54.36,39.5 55.51,38.35 U9.1 57.4,38.18 57.4,36.83 C49.1
  Top 0.813: U8.5 10.35,4.02 C48.2 10.41,4.08 v10.41,3.56 | v4.06,8.13 1.78,10.41 1.78,35.05 | 1.78,35.05 7.62,40.89 | v53.09,8.64 59.94,15.49 | 59.94,15.49 64.52,20.07 64.52,29.97 | 64.52,29.97 64.52,42.16 | 64.52,42.16 63.74,42.94 C53.2 C50.1 | 1.78,35.05 v1.78,48.01 | v29.21,64.01 29.99,64.01 | 29.82,63.07 29.64,63.25 29.46,63.25 | v14.48,64.01 15.24,64.01 15.26,63.99 | 15.26,63.99 C14.1 | 15.08,63.07 14.91,63.25 14.73,63.25 14.73,62.99 | 29.46,63.25 29.46,62.99 | C29.1 29.23,64.01 v29.21,64.01 | v29.21,64.01 29.46,63.75 29.46,63.25 | v43.94,64.01 44.7,64.01 44.72,63.99 C42.1 C43.1 | 44.55,63.07 44.38,63.25 44.2,63.25 | 44.2,63.25 44.2,63.5 | 44.2,63.25 44.2,62.99 | 59.45,64.01 v58.67,64.01 58.93,63.75 58.93,62.99 | 59.94,15.49 v57.91,17.53 | 47.5,44.45 v47.5,44.2 46.74,44.96 39.62,44.96 v36.58,48.01 | 47.5,44.45 47.5,44.96 | 47.5,44.96 47.48,44.97 C52.1 | 47.5,44.96 47.51,44.97 C51.1 | 47.5,44.45 48.51,44.45 | 64.52,29.97 57.66,36.83 57.4,36.83 57.15,36.83 | v33.27,48.01 30.73,48.01 29.46,49.28 29.46,51.82 | v64.52,45.47 64.52,42.16 | C15.1 15.26,63.99
  Bottom 0.254: v15.75,52.07 9.4,52.07 v8.64,52.83 | v14.22,35.81 14.22,37.59 v13.46,38.35 | v26.42,25.4 26.92,25.4 v28.96,23.37
  Bottom 0.813: v4.06,8.13 8.64,3.56 v10.41,3.56 32.51,3.56 | 32.51,3.56 48.01,3.56 v53.09,8.64 | v1.78,48.01 1.78,54.1 v8.89,61.21 11.68,64.01 | 11.68,64.01 v14.48,64.01 | 11.68,64.01 16.26,68.58 28.7,68.58 29.99,67.29 | 29.99,67.29 C29.1 29.23,64.01 v29.21,64.01 | 29.99,67.29 30.73,66.55 34.29,66.55 36.83,64.01 v43.94,64.01 46.48,66.55 49.78,66.55 53.59,62.74 57.4,62.74 | 57.4,62.74 v58.67,64.01 | v57.91,17.53 51.82,23.62 51.82,40.13 47.75,44.2 v47.5,44.2 | v36.58,48.01 v33.27,48.01 26.93,41.66 v26.93,41.65 | 57.4,62.74 59.44,62.74 64.52,57.66 v64.52,45.47 | 32.51,3.56 35.31,6.35 35.31,7.62 29.72,13.21 | 29.72,13.21 v27.69,15.24 27.69,13.72 v27.18,13.21 29.72,13.21

### Text on the board
tPlace: Worker SWD | IO | CK | STM32F030 | STM32F030 | STM32F030 | STM32F030 | 8MHz | 8MHz | 8MHz | 8MHz | 8MHz | DSY01 / Dooba System Board / [ 4x WKR / 2Mb Core / 64Mb SFSU ] / Power Supply: 4-6V 600mA / Nov 2016 <eresse@eresse.net> | SFSU SWD | IO | 8MHz | CK | STM32F030 | CKI | CKO | RDY | NOT | DIO | Core SWD | 5 | 7 | STM32F071 | CK | S25FL256S | IO | AS6C1608 | 0 | AP2112 | 15 | VIN | GND | RST | GND | RST
bPlace: -------------> 27pF | ----------> 100nF | -------> 4.7uF | ----> 10nF | -> 1uF | ---------> 330R | Dooba / DSY01 / by Eresse <eresse@eresse.net> | -----> LED | VIN: 4-6V 600mA / / Core: 2Mb RAM / SFSU: 32Mb Flash / Workers: 4 / / Holes: 2.2mm